# EAGLE design sepic 0.1 (EAGLE 9.6.2)
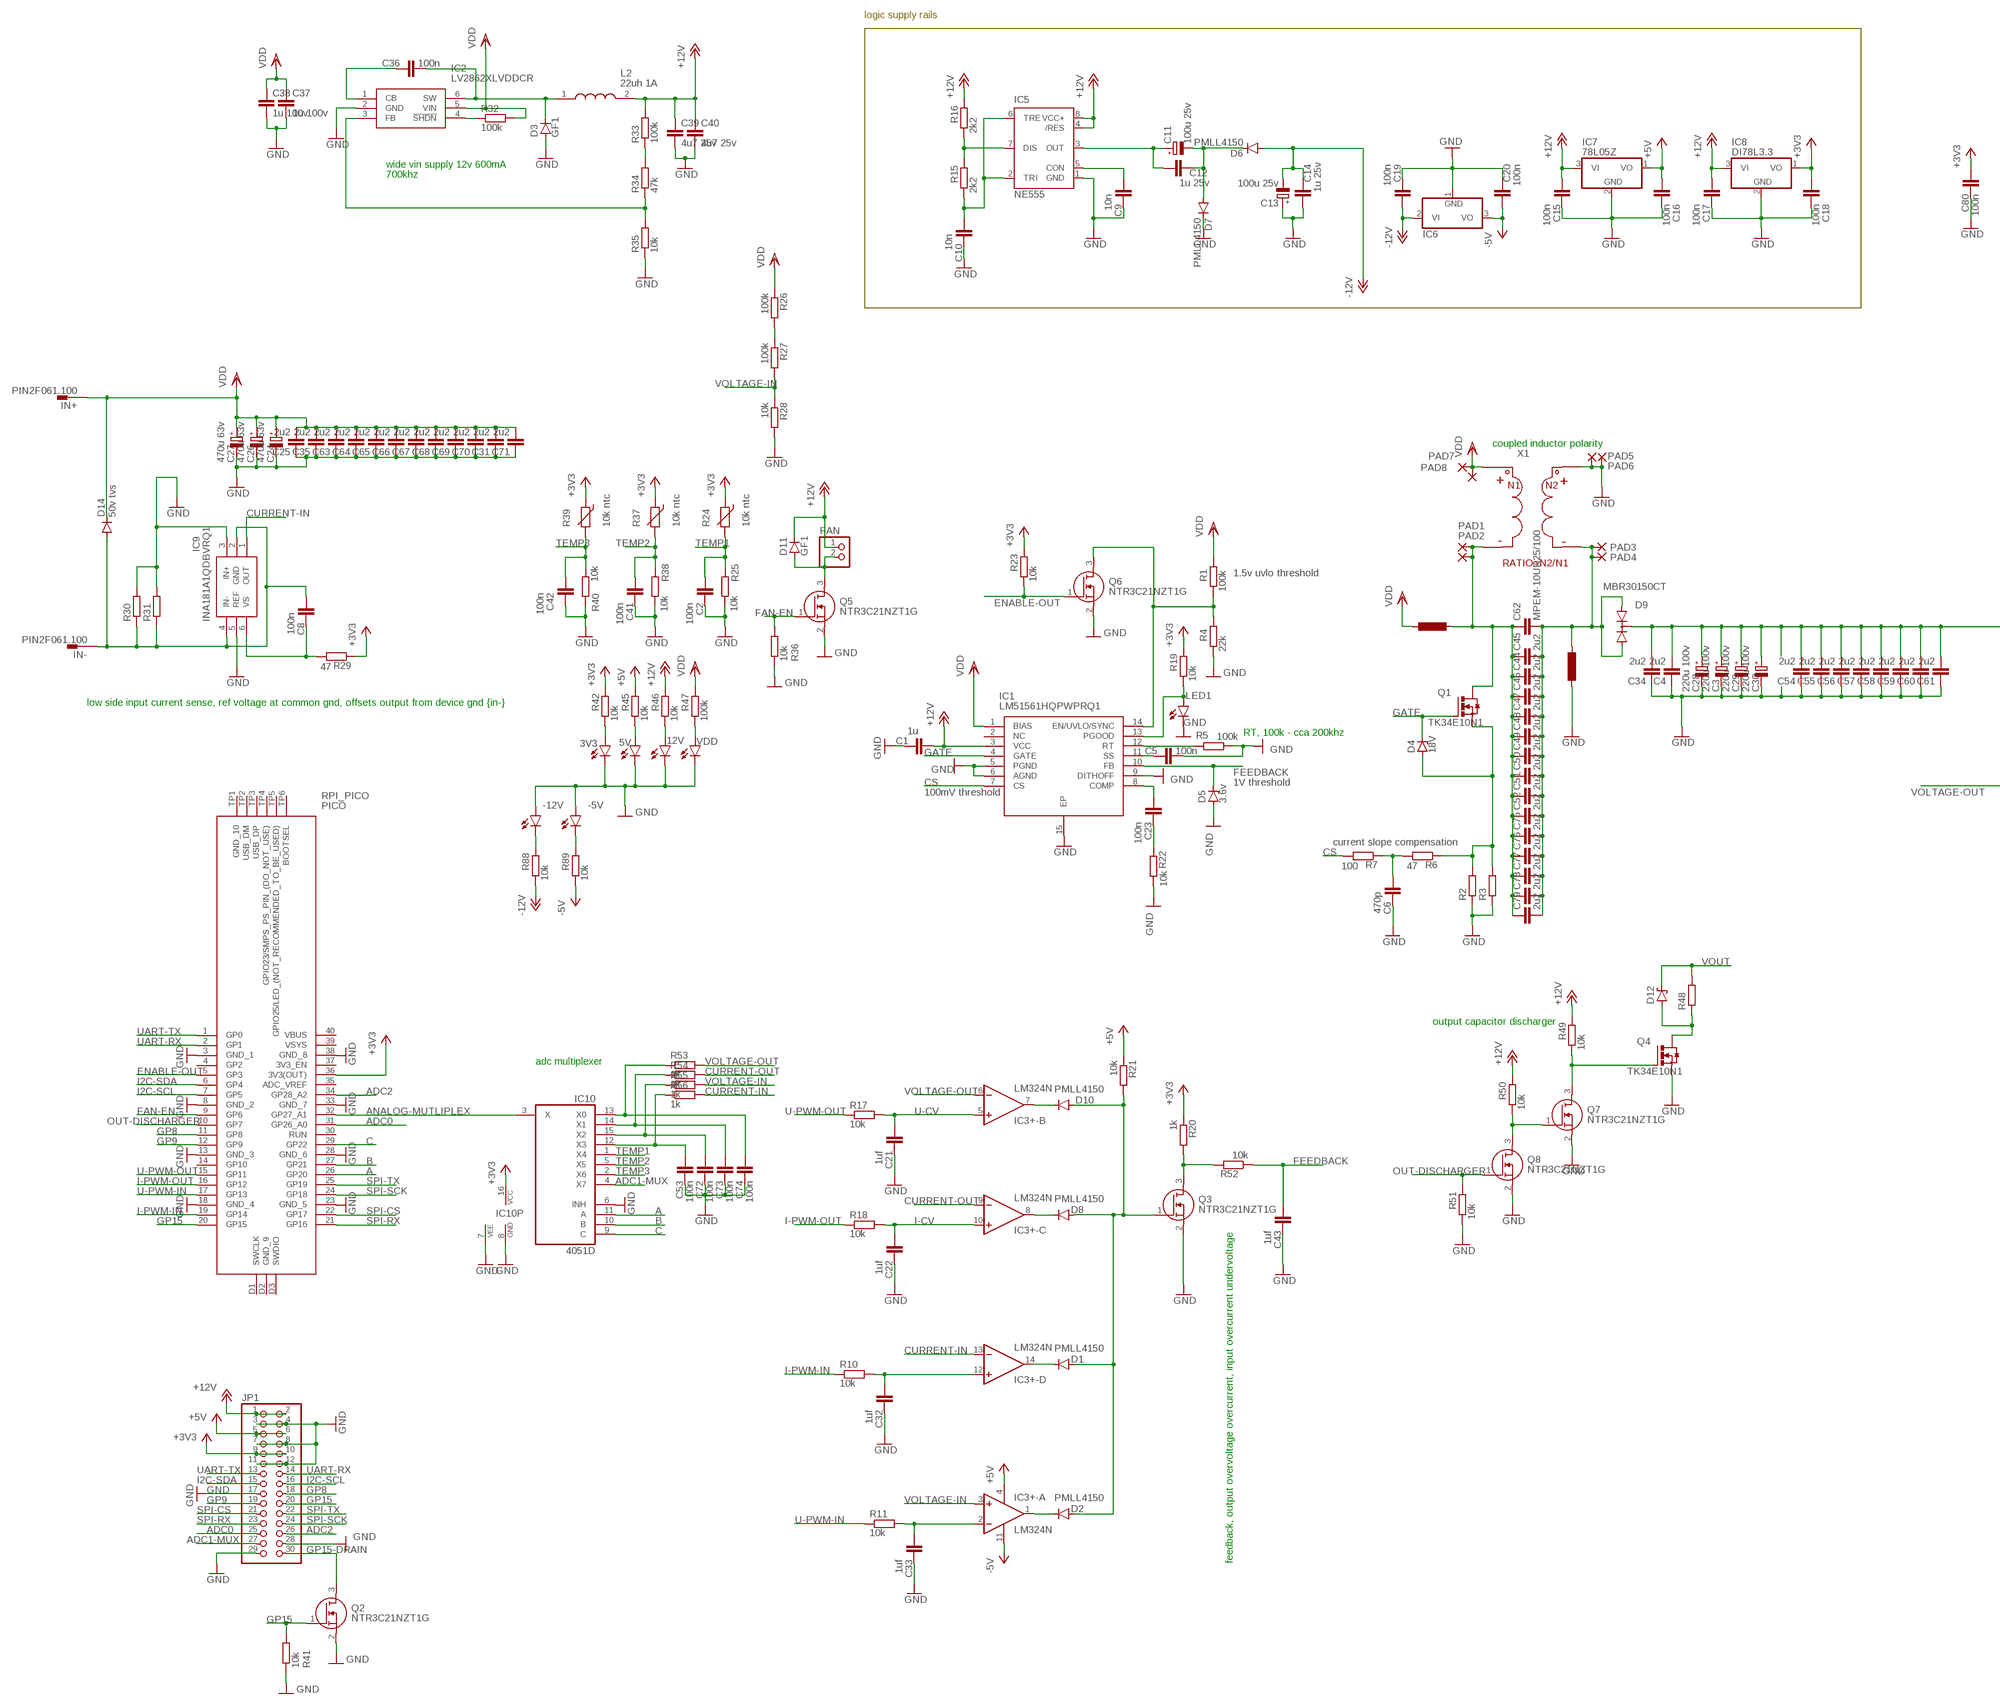
[diagram p0: schematic, sheet 1, part 1 of 2]
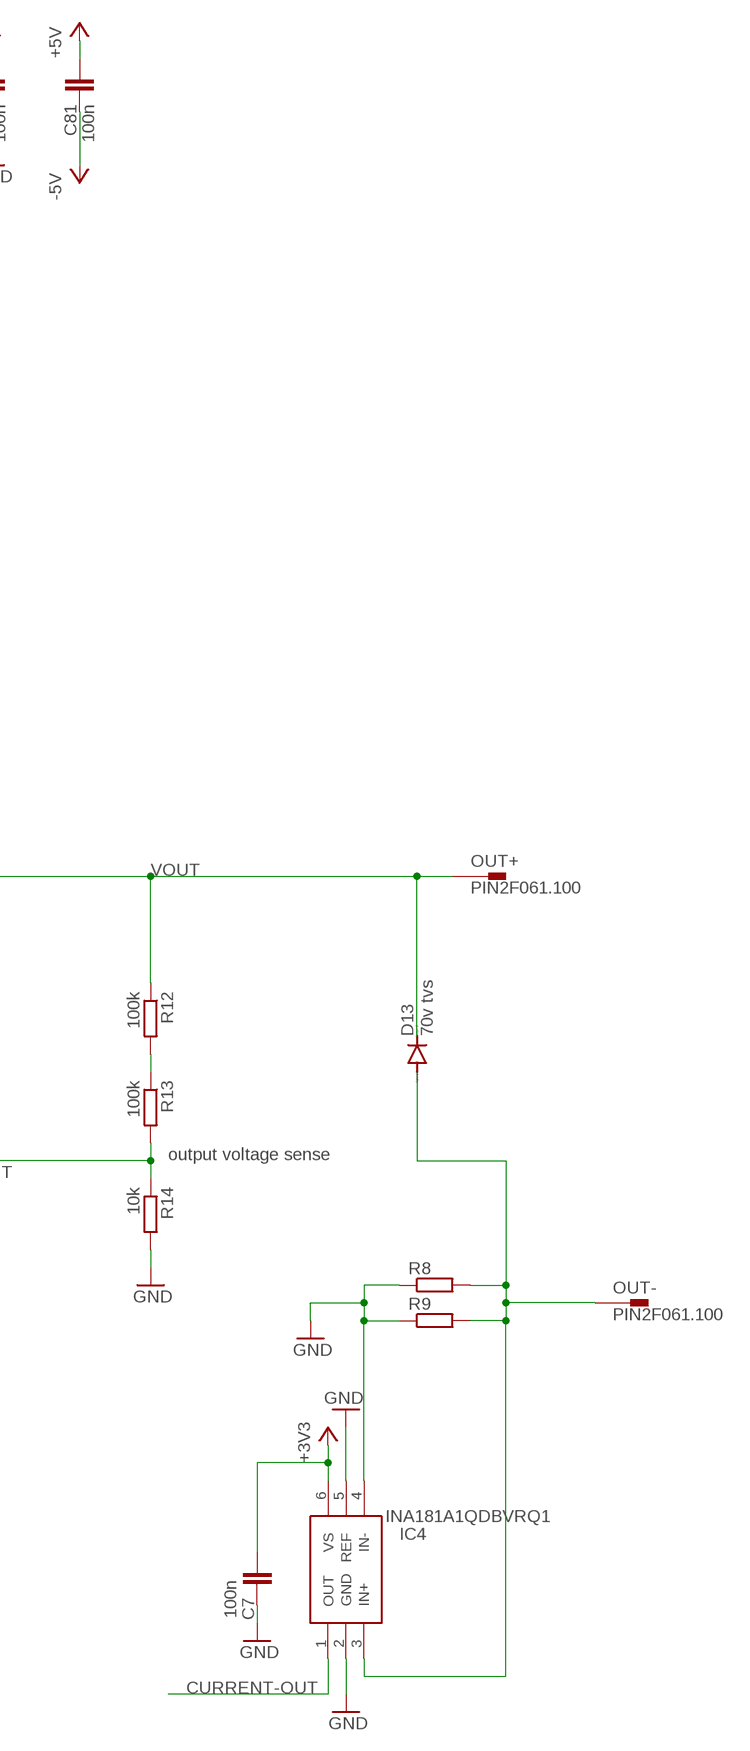
[diagram p1: schematic, sheet 1, part 2 of 2]

## Parts
3V3  LEDSML0805  [SML0805]
5V  LEDSML0805  [SML0805]
12V  LEDSML0805  [SML0805]
-5V  LEDSML0805  [SML0805]
-12V  LEDSML0805  [SML0805]
C1  1u  C-EUC0805  [C0805]
C2  100n  C-EUC0805  [C0805]
C3  220u 100v  CPOL-EUE7.5-16  [E7,5-16]
C4  2u2  C-EUC1210  [C1210]
C5  100n  C-EUC0805  [C0805]
C6  470p  C-EUC0805  [C0805]
C7  100n  C-EUC0805  [C0805]
C8  100n  C-EUC0805  [C0805]
C9  10n  C-EUC0805  [C0805]
C10  10n  C-EUC0805  [C0805]
C11  100u 25v  CPOL-EUE5-8.5  [E5-8,5]
C12  1u 25v  C-EUC0805  [C0805]
C13  100u 25v  CPOL-EUE5-8.5  [E5-8,5]
C14  1u 25v  C-EUC0805  [C0805]
C15  100n  C-EUC0805  [C0805]
C16  100n  C-EUC0805  [C0805]
C17  100n  C-EUC0805  [C0805]
C18  100n  C-EUC0805  [C0805]
C19  100n  C-EUC0805  [C0805]
C20  100n  C-EUC0805  [C0805]
C21  1uf  C-EUC0805  [C0805]
C22  1uf  C-EUC0805  [C0805]
C23  100n  C-EUC0805  [C0805]
C24  470u 63v  CPOL-EUE7.5-16  [E7,5-16]
C25  2u2  C-EUC1210  [C1210]
C26  470u 63v  CPOL-EUE7.5-16  [E7,5-16]
C27  470u 63v  CPOL-EUE7.5-16  [E7,5-16]
C28  220u 100v  CPOL-EUE7.5-16  [E7,5-16]
C29  220u 100v  CPOL-EUE7.5-16  [E7,5-16]
C30  220u 100v  CPOL-EUE7.5-16  [E7,5-16]
C31  2u2  C-EUC1210  [C1210]
C32  1uf  C-EUC0805  [C0805]
C33  1uf  C-EUC0805  [C0805]
C34  2u2  C-EUC1210  [C1210]
C35  2u2  C-EUC1210  [C1210]
C36  100n  C-EUC0805  [C0805]
C37  1u 100v  C-EUC1206  [C1206]
C38  1u 100v  C-EUC1206  [C1206]
C39  4u7 25v  C-EUC1206  [C1206]
C40  4u7 25v  C-EUC1206  [C1206]
C41  100n  C-EUC0805  [C0805]
C42  100n  C-EUC0805  [C0805]
C43  1uf  C-EUC0805  [C0805]
C44  2u2  C-EUC1210  [C1210]
C45  2u2  C-EUC1210  [C1210]
C46  2u2  C-EUC1210  [C1210]
C47  2u2  C-EUC1210  [C1210]
C48  2u2  C-EUC1210  [C1210]
C49  2u2  C-EUC1210  [C1210]
C50  2u2  C-EUC1210  [C1210]
C51  2u2  C-EUC1210  [C1210]
C52  2u2  C-EUC1210  [C1210]
C53  100n  C-EUC0805  [C0805]
C54  2u2  C-EUC1210  [C1210]
C55  2u2  C-EUC1210  [C1210]
C56  2u2  C-EUC1210  [C1210]
C57  2u2  C-EUC1210  [C1210]
C58  2u2  C-EUC1210  [C1210]
C59  2u2  C-EUC1210  [C1210]
C60  2u2  C-EUC1210  [C1210]
C61  2u2  C-EUC1210  [C1210]
C62  MPEM-10UR25/100  C-EU225-108X268  [C225-108X268]
C63  2u2  C-EUC1210  [C1210]
C64  2u2  C-EUC1210  [C1210]
C65  2u2  C-EUC1210  [C1210]
C66  2u2  C-EUC1210  [C1210]
C67  2u2  C-EUC1210  [C1210]
C68  2u2  C-EUC1210  [C1210]
C69  2u2  C-EUC1210  [C1210]
C70  2u2  C-EUC1210  [C1210]
C71  2u2  C-EUC1210  [C1210]
C72  100n  C-EUC0805  [C0805]
C73  100n  C-EUC0805  [C0805]
C74  100n  C-EUC0805  [C0805]
C75  2u2  C-EUC1210  [C1210]
C76  2u2  C-EUC1210  [C1210]
C77  2u2  C-EUC1210  [C1210]
C78  2u2  C-EUC1210  [C1210]
C79  2u2  C-EUC1210  [C1210]
C80  100n  C-EUC0805  [C0805]
C81  100n  C-EUC0805  [C0805]
D1  PMLL4150  [SOD80C]
D2  PMLL4150  [SOD80C]
D3  GF1  [SMA-DO214AC]
D4  18V  ZENER-DIODESOD80C  [SOD80C]
D5  3.6v  ZENER-DIODESOD80C  [SOD80C]
D6  PMLL4150  [SOD80C]
D7  PMLL4150  [SOD80C]
D8  PMLL4150  [SOD80C]
D9  MBR30150CT  BYW51F  [IW220ABS]
D10  PMLL4150  [SOD80C]
D11  GF1  [SMA-DO214AC]
D12  SCHOTTKY-DIODESMD  [SMB]
D13  70v tvs  DIODE-DO15-12  [DO15-12]
D14  50v tvs  DIODE-DO15-12  [DO15-12]
FAN  PINHD-1X2  [1X02]
IC1  LM51561HQPWPRQ1  [SOP65P640X120-15N]
IC2  LV2862XLVDDCR  [SOT95P280X110-6N]
IC3+-  LM324N  [DIL14]
IC4  INA181A1QDBVRQ1  [SOT95P280X145-6N]
IC5  NE555  [DIL-08]
IC6  79L05Z  [TO92]
IC7  78L05Z  [TO92]
IC8  DI78L3.3  78L05Z  [TO92]
IC9  INA181A1QDBVRQ1  [SOT95P280X145-6N]
IC10  4051D  [SO16]
IN+  PIN2F061.100  [F061.100]
IN-  PIN2F061.100  [F061.100]
JP1  PINHD-2X15  [2X15]
L2  22uh 1A  DER0705-47  [DER070547]
LED1  LEDSML0805  [SML0805]
OUT+  PIN2F061.100  [F061.100]
OUT-  PIN2F061.100  [F061.100]
PAD1  3,17/1,1  [3,17/1,1]
PAD2  3,17/1,1  [3,17/1,1]
PAD3  3,17/1,1  [3,17/1,1]
PAD4  3,17/1,1  [3,17/1,1]
PAD5  3,17/1,1  [3,17/1,1]
PAD6  3,17/1,1  [3,17/1,1]
PAD7  3,17/1,1  [3,17/1,1]
PAD8  3,17/1,1  [3,17/1,1]
Q1  TK34E10N1  IRF3704L-V  [TO262-V]
Q2  NTR3C21NZT1G  [SOT96P237X111-3N]
Q3  NTR3C21NZT1G  [SOT96P237X111-3N]
Q4  TK34E10N1  IRF3704L-V  [TO262-V]
Q5  NTR3C21NZT1G  [SOT96P237X111-3N]
Q6  NTR3C21NZT1G  [SOT96P237X111-3N]
Q7  NTR3C21NZT1G  [SOT96P237X111-3N]
Q8  NTR3C21NZT1G  [SOT96P237X111-3N]
R1  100k  R-EU_R0805  [R0805]
R2  R-EU_R2512  [R2512]
R3  R-EU_R2512  [R2512]
R4  22k  R-EU_R0805  [R0805]
R5  100k  R-EU_R0805  [R0805]
R6  47  R-EU_R0805  [R0805]
R7  100  R-EU_R0805  [R0805]
R8  R-EU_R2512  [R2512]
R9  R-EU_R2512  [R2512]
R10  10k  R-EU_R0805  [R0805]
R11  10k  R-EU_R0805  [R0805]
R12  100k  R-EU_R0805  [R0805]
R13  100k  R-EU_R0805  [R0805]
R14  10k  R-EU_R0805  [R0805]
R15  2k2  R-EU_R0805  [R0805]
R16  2k2  R-EU_R0805  [R0805]
R17  10k  R-EU_R0805  [R0805]
R18  10k  R-EU_R0805  [R0805]
R19  10k  R-EU_R0805  [R0805]
R20  1k  R-EU_R0805  [R0805]
R21  10k  R-EU_R0805  [R0805]
R22  10k  R-EU_R0805  [R0805]
R23  10k  R-EU_R0805  [R0805]
R24  10k ntc  THERMISTOR-2,5  [RS-2,5]
R25  10k  R-EU_R0805  [R0805]
R26  100k  R-EU_R0805  [R0805]
R27  100k  R-EU_R0805  [R0805]
R28  10k  R-EU_R0805  [R0805]
R29  47  R-EU_R0805  [R0805]
R30  R-EU_R2512  [R2512]
R31  R-EU_R2512  [R2512]
R32  100k  R-EU_R0805  [R0805]
R33  100k  R-EU_R0805  [R0805]
R34  47k  R-EU_R0805  [R0805]
R35  10k  R-EU_R0805  [R0805]
R36  10k  R-EU_R0805  [R0805]
R37  10k ntc  THERMISTOR-2,5  [RS-2,5]
R38  10k  R-EU_R0805  [R0805]
R39  10k ntc  THERMISTOR-2,5  [RS-2,5]
R40  10k  R-EU_R0805  [R0805]
R41  10k  R-EU_R0805  [R0805]
R42  10k  R-EU_R0805  [R0805]
R45  10k  R-EU_R0805  [R0805]
R46  10k  R-EU_R0805  [R0805]
R47  100k  R-EU_R0805  [R0805]
R48  R-EU_0817/22  [P0817/22]
R49  10k  R-EU_R0805  [R0805]
R50  10k  R-EU_R0805  [R0805]
R51  10k  R-EU_R0805  [R0805]
R52  10k  R-EU_R0805  [R0805]
R53  1k  R-EU_R0805  [R0805]
R54  1k  R-EU_R0805  [R0805]
R55  1k  R-EU_R0805  [R0805]
R56  1k  R-EU_R0805  [R0805]
R88  10k  R-EU_R0805  [R0805]
R89  10k  R-EU_R0805  [R0805]
RPI_PICO  PICO  [PICO]
VDD  LEDSML0805  [SML0805]
X1  TRANSFORMER  (no package)

## Nets
+3V3: C7.2 C18.2 C80.2 IC4.6(VS) IC8.1(VO) IC10.16(VCC) JP1.9 JP1.10 R19.2 R20.1 R23.2 R24.1 R29.1 R37.1 R39.1 R42.2 RPI_PICO.36(3V3(OUT))
+5V: C16.2 C81.2 IC3+-.4(P:V+) IC7.1(VO) JP1.5 JP1.6 R21.1 R45.2
+12V: C1.2 C15.2 C17.2 C39.1 C40.1 D11.K(C) FAN.1 IC1.3(VCC) IC5.4(/RES) IC5.8(VCC+) IC7.3(VI) IC8.3(VI) JP1.1 JP1.2 L2.2 R16.2 R33.2 R46.2 R49.2 R50.2
-5V: C20.1 C81.1 IC3+-.11(P:V-) IC6.3(VO) R89.1
-12V: C13.- C14.1 C19.1 D6.A IC6.2(VI) R88.1
A: IC10.11(A) RPI_PICO.26(GP20)
ADC0: JP1.25 RPI_PICO.31(GP26_A0)
ADC1-MUX: IC10.4(X7) JP1.27
ADC2: JP1.26 RPI_PICO.34(GP28_A2)
ANALOG-MUTLIPLEX: IC10.3(X) RPI_PICO.32(GP27_A1)
B: IC10.10(B) RPI_PICO.27(GP21)
C: IC10.9(C) RPI_PICO.29(GP22)
CS: IC1.7(CS) R7.2
CS1: D4.A Q1.3(S) R2.2 R3.2 R6.1
CURRENT-IN: IC3+-.13(D:-IN) IC9.1(OUT) R56.2
CURRENT-OUT: IC3+-.9(C:-IN) IC4.1(OUT) R54.2
ENABLE-OUT: Q6.1(G) R23.1 RPI_PICO.5(GP3)
FAN-EN: Q5.1(G) R36.2 RPI_PICO.9(GP6)
FEEDBACK: C43.2 D5.C IC1.10(FB) R52.1
GATE: D4.C IC1.4(GATE) Q1.1(G)
GND: 3V3.C 5V.C 12V.C -5V.A -12V.A C1.1 C2.1 C3.- C4.1 C5.2 C6.1 C7.1 C9.1 C10.1 C13.+ C14.2 C15.1 C16.1 C17.1 C18.1 C19.2 C20.2 C21.1 C22.1 C24.- C25.1 C26.- C27.- C28.- C29.- C30.- C31.1 C32.1 C33.1 C34.1 C35.1 C37.2 C38.2 C39.2 C40.2 C41.1 C42.1 C43.1 C53.1 C54.1 C55.1 C56.1 C57.1 C58.1 C59.1 C60.1 C61.1 C63.1 C64.1 C65.1 C66.1 C67.1 C68.1 C69.1 C70.1 C71.1 C72.1 C73.1 C74.1 C80.1 D3.A D5.A D7.C IC1.5(PGND) IC1.6(AGND) IC1.9(DITHOFF) IC1.15(EP) IC2.2(GND) IC4.2(GND) IC4.4(IN-) IC4.5(REF) IC5.1(GND) IC6.1(GND) IC7.2(GND) IC8.2(GND) IC9.3(IN+) IC9.5(REF) IC10.6(INH) IC10.7(VEE) IC10.8(GND) JP1.3 JP1.4 JP1.7 JP1.8 JP1.11 JP1.12 JP1.17 JP1.28 JP1.29 LED1.C PAD5.1(P) PAD6.1(P) Q2.2(S) Q3.2(S) Q4.3(S) Q5.2(S) Q6.2(S) Q7.2(S) Q8.2(S) R2.1 R3.1 R4.1 R5.1 R8.1 R9.1 R14.2 R22.2 R25.1 R28.2 R30.2 R31.2 R35.1 R36.1 R38.1 R40.1 R41.1 R51.1 RPI_PICO.3(GND_1) RPI_PICO.8(GND_2) RPI_PICO.13(GND_3) RPI_PICO.18(GND_4) RPI_PICO.23(GND_5) RPI_PICO.28(GND_6) RPI_PICO.33(GND_7) RPI_PICO.38(GND_8) VDD.C X1.P$3
GP8: JP1.18 RPI_PICO.11(GP8)
GP9: JP1.19 RPI_PICO.12(GP9)
GP15: JP1.20 Q2.1(G) R41.2 RPI_PICO.20(GP15)
GP15-DRAIN: JP1.30 Q2.3(D)
I2C-SCL: JP1.16 RPI_PICO.7(GP5)
I2C-SDA: JP1.15 RPI_PICO.6(GP4)
I-CV: C22.2 IC3+-.10(C:+IN) R18.2
I-PWM-IN: R10.1 RPI_PICO.19(GP14)
I-PWM-OUT: R18.1 RPI_PICO.16(GP12)
IN_GND: C8.2 D14.A IC9.2(GND) IC9.4(IN-) IN-.A1 IN-.A2 R30.1 R31.1
N$1: IC1.14(EN/UVLO/SYNC) Q6.3(D) R1.1 R4.2
N$2: C44.1 C45.1 C46.1 C47.1 C48.1 C49.1 C50.1 C51.1 C52.1 C62.1 C75.1 C76.1 C77.1 C78.1 C79.1 PAD1.1(P) PAD2.1(P) Q1.2(D) X1.P$2
N$3: C44.2 C45.2 C46.2 C47.2 C48.2 C49.2 C50.2 C51.2 C52.2 C62.2 C75.2 C76.2 C77.2 C78.2 C79.2 D9.A1 D9.A2 PAD3.1(P) PAD4.1(P) X1.P$4
N$4: C6.2 R6.2 R7.1
N$5: IC1.12(RT) R5.2
N$6: C5.1 IC1.11(SS)
N$7: C53.2 IC10.12(X3) R56.1
N$8: D10.C IC3+-.7(B:OUT)
N$9: D1.C IC3+-.14(D:OUT)
N$10: R12.2 R13.1
N$11: IC5.7(DIS) R15.2 R16.1
N$12: C10.2 IC5.2(TRI) IC5.6(TRE) R15.1
N$13: C9.2 IC5.5(CON)
N$14: C11.+ C12.2 IC5.3(OUT)
N$15: C11.- C12.1 D6.C D7.A
N$16: D8.C IC3+-.8(C:OUT)
N$17: D1.A D2.A D8.A D10.A Q3.1(G) R21.2
N$18: IC1.13(PGOOD) LED1.A R19.1
N$19: C23.2 IC1.8(COMP)
N$20: C23.1 R22.1
N$21: C32.2 IC3+-.12(D:+IN) R10.2
N$22: IC2.4(!SHDN) R32.1
N$23: C36.2 D3.K(C) IC2.6(SW) L2.1
N$24: D11.A FAN.2 Q5.3(D)
N$25: C36.1 IC2.1(CB)
N$26: R26.2 R27.1
N$27: C72.2 IC10.15(X2) R55.1
N$28: D2.C IC3+-.1(A:OUT)
N$29: C8.1 IC9.6(VS) R29.2
N$30: C33.2 IC3+-.2(A:-IN) R11.2
N$31: R33.1 R34.2
N$32: IC2.3(FB) R34.1 R35.2
N$33: 3V3.A R42.1
N$34: 5V.A R45.1
N$35: 12V.A R46.1
N$36: R47.1 VDD.A
N$37: -5V.C R89.2
N$38: -12V.C R88.2
N$39: D12.A Q4.2(D) R48.1
N$40: Q4.1(G) Q7.3(D) R49.1
N$41: Q7.1(G) Q8.3(D) R50.1
N$42: Q3.3(D) R20.2 R52.2
N$43: C73.2 IC10.14(X1) R54.1
N$44: C74.2 IC10.13(X0) R53.1
OUT-DISCHARGER: Q8.1(G) R51.2 RPI_PICO.10(GP7)
OUT_GND: D13.A IC4.3(IN+) OUT-.A1 OUT-.A2 R8.2 R9.2
SPI-CS: JP1.21 RPI_PICO.22(GP17)
SPI-RX: JP1.23 RPI_PICO.21(GP16)
SPI-SCK: JP1.24 RPI_PICO.24(GP18)
SPI-TX: JP1.22 RPI_PICO.25(GP19)
TEMP1: C2.2 IC10.1(X4) R24.2 R25.2
TEMP2: C41.2 IC10.5(X5) R37.2 R38.2
TEMP3: C42.2 IC10.2(X6) R39.2 R40.2
U-CV: C21.2 IC3+-.5(B:+IN) R17.2
U-PWM-IN: R11.1 RPI_PICO.17(GP13)
U-PWM-OUT: R17.1 RPI_PICO.15(GP11)
UART-RX: JP1.14 RPI_PICO.2(GP1)
UART-TX: JP1.13 RPI_PICO.1(GP0)
VDD: C24.+ C25.2 C26.+ C27.+ C31.2 C35.2 C37.1 C38.1 C63.2 C64.2 C65.2 C66.2 C67.2 C68.2 C69.2 C70.2 C71.2 D14.C IC1.1(BIAS) IC2.5(VIN) IN+.A1 IN+.A2 PAD7.1(P) PAD8.1(P) R1.2 R26.1 R32.2 R47.2 X1.P$1
VOLTAGE-IN: IC3+-.3(A:+IN) R27.2 R28.1 R55.2
VOLTAGE-OUT: IC3+-.6(B:-IN) R13.2 R14.1 R53.2
VOUT: C3.+ C4.2 C28.+ C29.+ C30.+ C34.2 C54.2 C55.2 C56.2 C57.2 C58.2 C59.2 C60.2 C61.2 D9.C D12.C D13.C OUT+.A1 OUT+.A2 R12.1 R48.2
Unconnected: IC1.2(NC) RPI_PICO.4(GP2) RPI_PICO.14(GP10) RPI_PICO.30(RUN) RPI_PICO.35(ADC_VREF) RPI_PICO.37(3V3_EN) RPI_PICO.39(VSYS) RPI_PICO.40(VBUS) RPI_PICO.D1(SWCLK) RPI_PICO.D2(GND_9) RPI_PICO.D3(SWDIO) RPI_PICO.TP1(GND_10) RPI_PICO.TP2(USB_DM) RPI_PICO.TP3(USB_DP) RPI_PICO.TP4(GPIO23/SMPS_PS_PIN_(DO_NOT_USE)) RPI_PICO.TP5(GPIO25/LED_(NOT_RECOMMENDED_TO_BE_USED)) RPI_PICO.TP6(BOOTSEL)

## Notes on the sheet
- logic supply rails
- wide vin supply 12v 600mA
- 700khz
- coupled inductor polarity
- 1.5v uvlo threshold
- low side input current sense, ref voltage at common gnd, offsets output from device gnd {in-}
- RT, 100k - cca 200khz
- 1V threshold | output voltage sense
- 100mV threshold
- current slope compensation
- output capacitor discharger
- adc multiplexer
- feedback, output overvoltage overcurrent, input overcurrent undervoltage

## Library data of the parts
3V3 5V 12V -5V -12V LED1 VDD = led:LED: LED OSRAM: - CHIPLED LG R971, LG N971, LY N971, LG Q971, LY Q971, LO R971, LY R971 LH N974, LH R974 LS Q976, LO Q976, LY Q976 LO Q996 - Hyper CHIPLED LW Q18S LB Q993, LB Q99A, LB R99A - SideLED LS A670, LO A670, LY A670, LG A670, LP A670 LB A673, LV A673, LT A673, LW A673 LH A674 LY A675 LS A676, LA A676, LO A676, LY A676, LW A676 LS A679, LY A679, LG A679 - Hyper Micro SIDELED® LS Y876, LA Y876, LO Y876, LY Y876 LT Y87S - SmartLED LW L88C, LW L88S LB L89C, LB L89S, LG L890 LS L89K, LO L89K, LY L89K LS L896, LA L896, LO L896, LY L896 - TOPLED LS T670, LO T670, LY T670, LG T670, LP T670 LSG T670, LSP T670, LSY T670, LOP T670, LYG T670 LG T671, LOG T671, LSG T671 LB T673, LV T673, LT T673, LW T673 LH T674 LS T676, LA T676, LO T676, LY T676, LB T676, LH T676, LSB T676, LW T676 LB T67C, LV T67C, LT T67C, LS T67K, LO T67K, LY T67K, LW E67C LS E67B, LA E67B, LO E67B, LY E67B, LB E67C, LV E67C, LT E67C LW T67C LS T679, LY T679, LG T679 LS T770, LO T770, LY T770, LG T770, LP T770 LB T773, LV T773, LT T773, LW T773 LH T774 LS E675, LA E675, LY E675, LS T675 LS T776, LA T776, LO T776, LY T776, LB T776 LHGB T686 LT T68C, LB T68C - Hyper Mini TOPLED® LB M676 - Mini TOPLED Santana® LG M470 LS M47K, LO M47K, LY M47K Source: http://www.osram.convergy.de LUXEON: - LUMILED® LXK2-PW12-R00, LXK2-PW12-S00, LXK2-PW14-U00, LXK2-PW14-V00 LXK2-PM12-R00, LXK2-PM12-S00, LXK2-PM14-U00 LXK2-PE12-Q00, LXK2-PE12-R00, LXK2-PE12-S00, LXK2-PE14-T00, LXK2-PE14-U00 LXK2-PB12-K00, LXK2-PB12-L00, LXK2-PB12-M00, LXK2-PB14-N00, LXK2-PB14-P00, LXK2-PB14-Q00 LXK2-PR12-L00, LXK2-PR12-M00, LXK2-PR14-Q00, LXK2-PR14-R00 LXK2-PD12-Q00, LXK2-PD12-R00, LXK2-PD12-S00 LXK2-PH12-R00, LXK2-PH12-S00 LXK2-PL12-P00, LXK2-PL12-Q00, LXK2-PL12-R00 Source: www.luxeon.com KINGBRIGHT: KA-3528ASYC Source: www.kingbright.com
C1 C2 C4-C10 C12 C14-C23 C25 C31-C81 = rcl:C-EU: CAPACITOR, European symbol; SPICEPREFIX: C
C3 C11 C13 C24 C26-C30 = rcl:CPOL-EU: POLARIZED CAPACITOR, European symbol; SPICEPREFIX: C
D1 D2 D6-D8 D10 = diode:PMLL4150: DIODE high speed
D3 D11 = diode:GF1: DIODE
D4 D5 = diode:ZENER-DIODE: Z-Diode
D9 = diode:BYW51F: DIODE dual ultra fast diode, 200 V (ST)
D12 = diode:SCHOTTKY-DIODE: Schottky Diode
D13 D14 = diode:DIODE-: DIODE
FAN = pinhead:PINHD-1X2: PIN HEADER
IC1 = SamacSys_Parts:LM51561HQPWPRQ1: Switching Controllers 2.2-MHz wide VIN nonsynchronous boost, flyback, & SEPIC controller with spread spectrum and hiccup 14-HTSSOP -40 to 150 Source: Datasheet <https://www.ti.com/lit/ds/symlink/lm51561h-q1.pdf?ts=1627804553819&ref_url=https%3A%2F%2Fwww.ti.com%2Fstore%2Fti%2Fen%2Fp%2Fproduct%2F%3Fp%3DLM51561HQPWPRQ1>; ARROW_PART_NUMBER: LM51561HQPWPRQ1; ARROW_PRICE-STOCK: https://www.arrow.com/en/products/lm51561hqpwprq1/texas-instruments?region=nac; DESCRIPTION: Switching Controllers 2.2-MHz wide VIN nonsynchronous boost, flyback, & SEPIC controller with spread spectrum and hiccup 14-HTSSOP -40 to 150; HEIGHT: 1.2mm; MANUFACTURER_NAME: Texas Instruments; MANUFACTURER_PART_NUMBER: LM51561HQPWPRQ1; MOUSER_PART_NUMBER: 595-LM51561HQPWPRQ1; MOUSER_PRICE-STOCK: https://www.mouser.co.uk/ProductDetail/Texas-Instruments/LM51561HQPWPRQ1?qs=zW32dvEIR3vSrITqODfvSg%3D%3D
IC2 = SamacSys_Parts:LV2862XLVDDCR: Conv DC-DC 4V to 60V Step Down Single-Out -1V to 65V 0.6A Automotive T/R Source: Datasheet <https://www.ti.com/lit/gpn/LV2862>; ARROW_PART_NUMBER: LV2862XLVDDCR; ARROW_PRICE-STOCK: https://www.arrow.com/en/products/lv2862xlvddcr/texas-instruments?region=nac; DESCRIPTION: Conv DC-DC 4V to 60V Step Down Single-Out -1V to 65V 0.6A Automotive T/R; HEIGHT: 1.1mm; MANUFACTURER_NAME: Texas Instruments; MANUFACTURER_PART_NUMBER: LV2862XLVDDCR; MOUSER_PART_NUMBER: 595-LV2862XLVDDCR; MOUSER_PRICE-STOCK: https://www.mouser.co.uk/ProductDetail/Texas-Instruments/LV2862XLVDDCR?qs=XJu%252BLGjWfSCoT1RiKkHrOA%3D%3D
IC3+- = linear:LM324: OP AMP
IC4 IC9 = SamacSys_Parts:INA181A1QDBVRQ1: AEC-Q100, 26V, bi-directional, low-/high-side, voltage output current sense amplifier Source: Datasheet <http://www.ti.com/lit/gpn/INA181-Q1>; ARROW_PART_NUMBER: INA181A1QDBVRQ1; ARROW_PRICE-STOCK: https://www.arrow.com/en/products/ina181a1qdbvrq1/texas-instruments?region=nac; DESCRIPTION: AEC-Q100, 26V, bi-directional, low-/high-side, voltage output current sense amplifier; HEIGHT: 1.45mm; MANUFACTURER_NAME: Texas Instruments; MANUFACTURER_PART_NUMBER: INA181A1QDBVRQ1; MOUSER_PART_NUMBER: 595-INA181A1QDBVRQ1; MOUSER_PRICE-STOCK: https://www.mouser.co.uk/ProductDetail/Texas-Instruments/INA181A1QDBVRQ1?qs=EBDBlbfErPx7yYU5sEtaJQ%3D%3D
IC5 = st-microelectronics:NE555: General purpose bipolar Timer; MF: Arrow Electronics; MPN: NE555N; OC_FARNELL: 1467742; OC_NEWARK: 89K1486
IC6 = linear:79*: Negative VOLTAGE REGULATOR
IC7 IC8 = linear:78*: Positive VOLTAGE REGULATOR Source: http://cache.national.com/ds/LM/LM78L05.pdf http://www.fairchildsemi.com/ds/LM/LM7805.pdf
IC10 = 40xx:4051: 8-channel ANALOG MULTIPLEXER
IN+ IN- OUT+ OUT- = con-faston:PIN2: Flachstecker Typ Tyco/Electronics/AMP TAB, FASTON Printed Circuit Board Tabs Source: http://www.buerklin.com, http://catalog.tycoelectronics.com; OC_FARNELL: unknown; OC_NEWARK: unknown
JP1 = pinhead:PINHD-2X15: PIN HEADER
L2 = SamacSys_Parts:DER0705-47: Inductor: wire; SMD; 47uH; 0.75A; 0.221; 7.6x7.6x5.1mm; +/-20% Source: Datasheet <https://www.tme.eu/Document/9a80d44ac7714b3daaf4f9db6ecfd32c/der.pdf>; DESCRIPTION: Inductor: wire; SMD; 47uH; 0.75A; 0.221; 7.6x7.6x5.1mm; +/-20%; HEIGHT: 5.1mm; MANUFACTURER_NAME: FERROCORE; MANUFACTURER_PART_NUMBER: DER0705-47
PAD1-PAD8 = wirepad:3,17/1,1: THROUGH-HOLE PAD
Q1 Q4 = transistor-power:IRF3704: SMPS MOSFET HEXFET® Power MOSFET Source: http://www.irf.com/product-info/datasheets/data/irf3704.pdf
Q2 Q3 Q5-Q8 = SamacSys_Parts:NTR3C21NZT1G: ON SEMICONDUCTOR - NTR3C21NZT1G - MOSFET, N-CH, 20V, 3.6A, SOT-23 Source: Datasheet <https://mouser.componentsearchengine.com/Datasheets/2/NTR3C21NZT1G.pdf>; ARROW_PART_NUMBER: NTR3C21NZT1G; ARROW_PRICE-STOCK: https://www.arrow.com/en/products/ntr3c21nzt1g/on-semiconductor; DESCRIPTION: ON SEMICONDUCTOR - NTR3C21NZT1G - MOSFET, N-CH, 20V, 3.6A, SOT-23; HEIGHT: 1.11mm; MANUFACTURER_NAME: onsemi; MANUFACTURER_PART_NUMBER: NTR3C21NZT1G; MOUSER_PART_NUMBER: 863-NTR3C21NZT1G; MOUSER_PRICE-STOCK: https://www.mouser.co.uk/ProductDetail/onsemi/NTR3C21NZT1G?qs=tCMd4XlZ%2FiDqlfJKftdpPA%3D%3D
R1-R23 R25-R36 R38 R40-R42 R45-R56 R88 R89 = rcl:R-EU_: RESISTOR, European symbol; SPICEPREFIX: R
R24 R37 R39 = varistor:THERMISTOR: THERMISTOR
RPI_PICO = SamacSys_Parts:PICO: RP2040 microcontroller chip designed by Raspberry Pi in the United Kingdom 2 SPI, 2 I2C, 2 UART, 3 12-bit ADC, 16 controllable PWM channels Source: Datasheet <https://datasheets.raspberrypi.org/pico/pico_datasheet.pdf>; DESCRIPTION: RP2040 microcontroller chip designed by Raspberry Pi in the United Kingdom 2 SPI, 2 I2C, 2 UART, 3 12-bit ADC, 16 controllable PWM channels; HEIGHT: 1mm; MANUFACTURER_NAME: RASPBERRY-PI; MANUFACTURER_PART_NUMBER: PICO
X1 = ngspice-simulation:TRANSFORMER: Coupled inductors The RATIO is defined in the schematic by using the text command and adding a line that says: .PARAM RATIO=x Where x is the turns ratio of the transformer

## Board
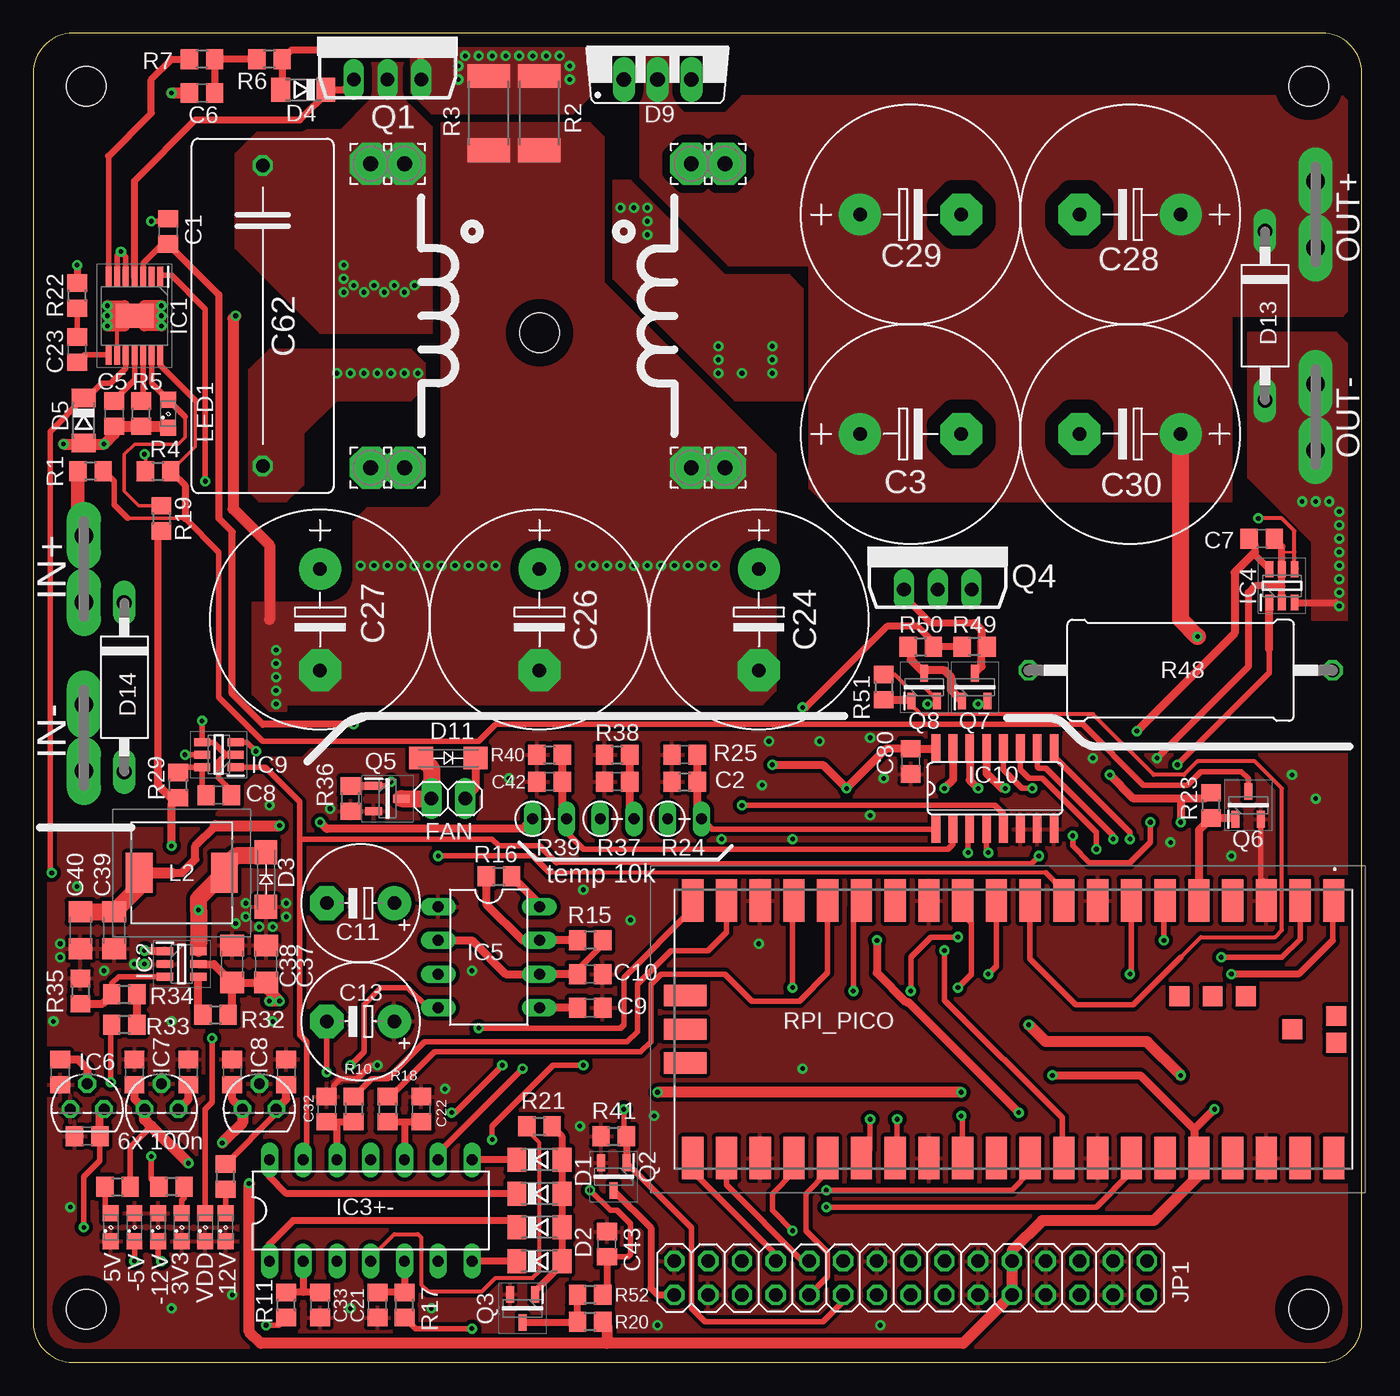
[diagram p2: board, top side]
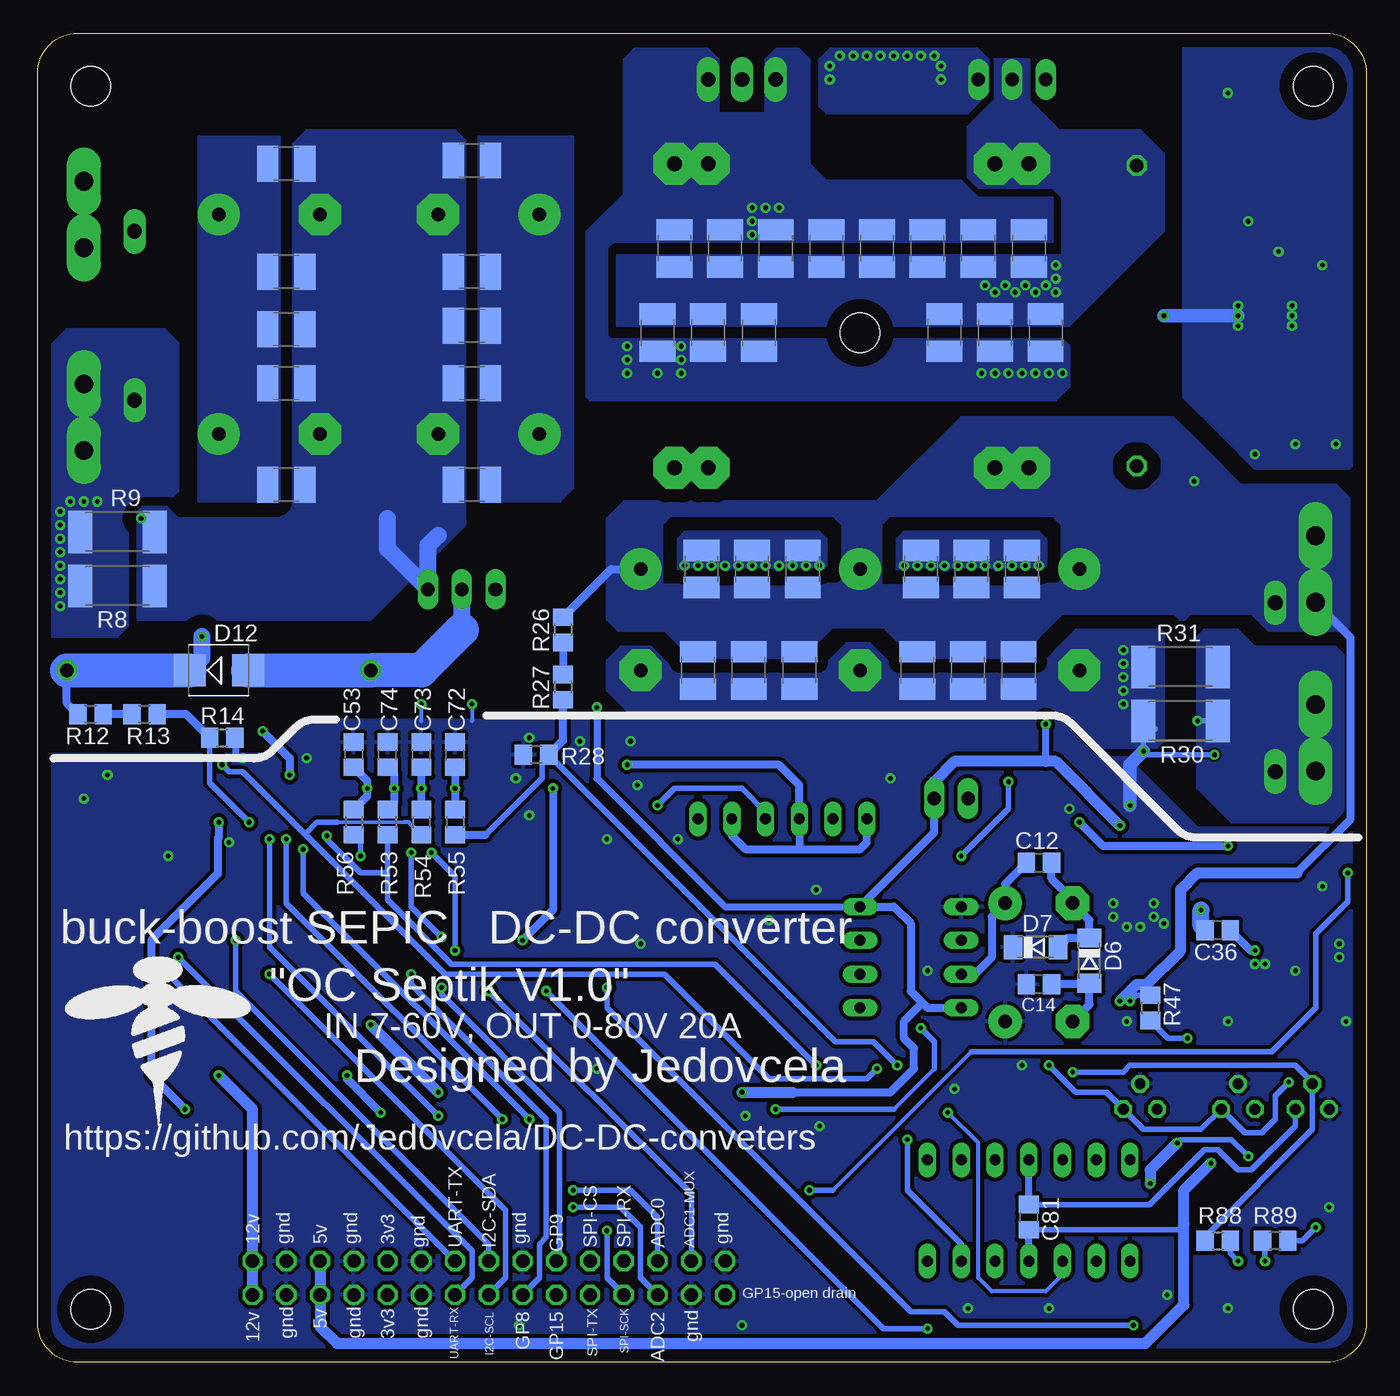
[diagram p3: board, bottom side, seen from below]

Size 100 x 100 mm. Coordinates in mm from the lower left corner, seen from the top.
Outline: 0,97 0,3 arc90 3,0 97,0 arc90 100,3 100,97 arc90 97,100 3,100 arc90 0,97
Copper layers (1*16): Top 0.035mm / dielectric 1.5mm / Bottom 0.035mm
Design rules "default *": minimum track width 6mil, minimum drill 0.35mm, track to track 6mil, track to pad 6mil, pad to pad 6mil, via to via 6mil, smd to smd 6mil, copper to edge 40mil, drill to drill 6mil, minimum pad ring 10mil, minimum via ring 8mil, stop-mask expansion 4mil, vias tented up to drill 15mil, thermal gap 10mil
Holes 3 mm at 4,96 96,96 96,4 4,4 38.1,77.47

### Footprints (pad centres in the part's own frame; a part is rotated, then mirrored left to right if it is on the bottom)
SML0805 = smd 1.2 x 1.2: A 1.05,0; C -1.05,0
C0805 = smd 1.3 x 1.5: 1 -0.95,0; 2 0.95,0
E7,5-16 = drill 1.016 pad 3.15: + -3.81,0 | drill 1.016 pad 3.15 octagon: - 3.81,0
C1210 = smd 1.6 x 2.7: 1 -1.4,0; 2 1.4,0
E5-8,5 = drill 1.016 pad 2.54: + -2.54,0 | drill 1.016 pad 2.54 octagon: - 2.54,0
C1206 = smd 1.6 x 1.8: 1 -1.4,0; 2 1.4,0
C225-108X268 = drill 1.016 octagon: 1 -11.303,0; 2 11.303,0
SOD80C = smd 1.4 x 1.8: A 1.7,0; C -1.7,0
SMA-DO214AC = smd 1.8 x 1.7: A -2.05,0; K 2.05,0
IW220ABS = drill 1.118 long: A1 -2.54,-2.54; A2 2.54,-2.54; C 0,-2.54
SMB = smd 2.4 x 2.4: A 2.2,0; C -2.2,0
DO15-12 = drill 1.118 long: A 6.35,0; C -6.35,0
1X02 = drill 1.016 long: 1 -1.27,0; 2 1.27,0
SOP65P640X120-15N = smd 1.475 x 0.45: 1 -2.938,1.95; 2 -2.938,1.3; 3 -2.938,0.65; 4 -2.938,0; 5 -2.938,-0.65; 6 -2.938,-1.3; 7 -2.938,-1.95; 8 2.938,-1.95; 9 2.938,-1.3; 10 2.938,-0.65; 11 2.938,0; 12 2.938,0.65; 13 2.938,1.3; 14 2.938,1.95 | smd 1.82 x 2.86: 15 0,0
SOT95P280X110-6N = smd 1.25 x 0.6: 1 -1.25,0.95; 2 -1.25,0; 3 -1.25,-0.95; 4 1.25,-0.95; 5 1.25,0; 6 1.25,0.95
DIL14 = drill 0.813 long: 1 -7.62,-3.81; 2 -5.08,-3.81; 3 -2.54,-3.81; 4 0,-3.81; 5 2.54,-3.81; 6 5.08,-3.81; 7 7.62,-3.81; 8 7.62,3.81; 9 5.08,3.81; 10 2.54,3.81; 11 0,3.81; 12 -2.54,3.81; 13 -5.08,3.81; 14 -7.62,3.81
SOT95P280X145-6N = smd 1.2 x 0.6: 1 -1.25,0.95; 2 -1.25,0; 3 -1.25,-0.95; 4 1.25,-0.95; 5 1.25,0; 6 1.25,0.95
DIL-08 = drill 0.813 long: 1 -3.81,-3.81; 2 -1.27,-3.81; 3 1.27,-3.81; 4 3.81,-3.81; 5 3.81,3.81; 6 1.27,3.81; 7 -1.27,3.81; 8 -3.81,3.81
TO92 = drill 0.813 octagon: 1 -1.27,0; 2 0,1.905; 3 1.27,0
SO16 = smd 0.66 x 2.032: 1 -4.445,-3.073; 2 -3.175,-3.073; 3 -1.905,-3.073; 4 -0.635,-3.073; 5 0.635,-3.073; 6 1.905,-3.073; 7 3.175,-3.073; 8 4.445,-3.073; 9 4.445,3.073; 10 3.175,3.073; 11 1.905,3.073; 12 0.635,3.073; 13 -0.635,3.073; 14 -1.905,3.073; 15 -3.175,3.073; 16 -4.445,3.073
F061.100 = drill 1.4 pad 2.54 long: A1 -2.5,0; A2 2.5,0
2X15 = drill 1.016 octagon: 1 -17.78,-1.27; 2 -17.78,1.27; 3 -15.24,-1.27; 4 -15.24,1.27; 5 -12.7,-1.27; 6 -12.7,1.27; 7 -10.16,-1.27; 8 -10.16,1.27; 9 -7.62,-1.27; 10 -7.62,1.27; 11 -5.08,-1.27; 12 -5.08,1.27; 13 -2.54,-1.27; 14 -2.54,1.27; 15 0,-1.27; 16 0,1.27; 17 2.54,-1.27; 18 2.54,1.27; 19 5.08,-1.27; 20 5.08,1.27; 21 7.62,-1.27; 22 7.62,1.27; 23 10.16,-1.27; 24 10.16,1.27; 25 12.7,-1.27; 26 12.7,1.27; 27 15.24,-1.27; 28 15.24,1.27; 29 17.78,-1.27; 30 17.78,1.27
DER070547 = smd 2 x 3: 1 -3.2,0; 2 3.2,0
3,17/1,1 = drill 1.118 pad 3.175 octagon: 1 0,0
TO262-V = drill 1.016 long: 1 -2.54,0; 2 0,0; 3 2.54,0
SOT96P237X111-3N = smd 1.25 x 0.6: 1 -1.05,0.955; 2 -1.05,-0.955; 3 1.05,0
R0805 = smd 1.3 x 1.5: 1 -0.95,0; 2 0.95,0
R2512 = smd 1.8 x 3.2: 1 -2.8,0; 2 2.8,0
RS-2,5 = drill 0.813 long: 1 -1.27,0; 2 1.27,0
P0817/22 = drill 1.016 octagon: 1 -11.43,0; 2 11.43,0
PICO = smd 3.2 x 1.6: 1 0.81,49.63; 2 0.81,47.09; 3 0.81,44.55; 4 0.81,42.01; 5 0.81,39.47; 6 0.81,36.93; 7 0.81,34.39; 8 0.81,31.85; 9 0.81,29.31; 10 0.81,26.77; 11 0.81,24.23; 12 0.81,21.69; 13 0.81,19.15; 14 0.81,16.61; 15 0.81,14.07; 16 0.81,11.53; 17 0.81,8.99; 18 0.81,6.45; 19 0.81,3.91; 20 0.81,1.37; 21 20.19,1.37; 22 20.19,3.91; 23 20.19,6.45; 24 20.19,8.99; 25 20.19,11.53; 26 20.19,14.07; 27 20.19,16.61; 28 20.19,19.15; 29 20.19,21.69; 30 20.19,24.23; 31 20.19,26.77; 32 20.19,29.31; 33 20.19,31.85; 34 20.19,34.39; 35 20.19,36.93; 36 20.19,39.47; 37 20.19,42.01; 38 20.19,44.55; 39 20.19,47.09; 40 20.19,49.63 | smd 1.6 x 3.2: D1 7.96,0.8; D2 10.5,0.8; D3 13.04,0.8 | smd 1.5 x 1.5: TP1 10.5,46.5; TP2 11.5,49.8; TP3 9.5,49.8; TP4 8,43; TP5 8,40.5; TP6 8,38

### Placement (x,y rotation side)
3V3  11.18,10.16 90 top
5V  5.84,10.16 90 top
12V  14.48,10.16 90 top
-5V  7.62,10.16 90 top
-12V  9.4,10.16 90 top
C1  10.16,85.09 270 top
C2  49.02,45.72 0 top
C3  66.04,69.85 0 top
C4  81.28,90.17 180 bottom
C5  6.1,71.37 270 top
C6  12.7,95.5 0 top
C7  92.46,61.98 180 top
C8  13.97,42.67 0 top
C9  41.91,26.67 180 top
C10  41.91,29.21 180 top
C11  24.64,34.54 180 top
C12  24.64,37.59 180 bottom
C13  24.64,25.65 180 top
C14  24.64,28.45 180 bottom
C15  11.68,21.84 270 top
C16  7.62,21.84 270 top
C17  19.05,21.84 270 top
C18  14.99,21.84 270 top
C19  2.03,21.84 270 top
C20  4.06,17.02 180 top
C21  25.91,4.32 90 top
C22  29.21,19.05 270 top
C23  3.3,76.2 270 top
C24  54.61,55.88 270 top
C25  50.04,59.69 270 bottom
C26  38.1,55.88 270 top
C27  21.59,55.88 270 top
C28  82.55,86.36 180 top
C29  66.04,86.36 0 top
C30  82.55,69.85 180 top
C31  50.29,52.07 90 bottom
C32  22.1,19.05 270 top
C33  21.59,4.32 90 top
C34  81.28,66.04 180 bottom
C35  46.23,59.69 270 bottom
C36  11.18,32.51 180 bottom
C37  17.53,29.97 90 top
C38  14.99,29.97 90 top
C39  6.1,32.51 270 top
C40  3.56,32.51 270 top
C41  43.94,43.69 0 top
C42  38.86,43.69 0 top
C43  43.18,8.89 270 top
C44  48.26,83.82 90 bottom
C45  52.07,83.82 90 bottom
C46  44.45,83.82 90 bottom
C47  40.64,83.82 90 bottom
C48  36.83,83.82 90 bottom
C49  27.94,77.47 270 bottom
C50  31.75,77.47 270 bottom
C51  45.72,77.47 270 bottom
C52  49.53,77.47 270 bottom
C53  76.2,45.72 270 bottom
C54  81.28,82.04 180 bottom
C55  81.28,77.72 180 bottom
C56  81.28,73.66 180 bottom
C57  67.31,90.42 0 bottom
C58  67.31,82.04 0 bottom
C59  67.31,77.98 0 bottom
C60  67.31,73.66 0 bottom
C61  67.31,66.04 0 bottom
C62  17.27,78.74 270 top
C63  42.67,52.07 90 bottom
C64  26.16,52.07 90 bottom
C65  33.53,59.69 270 bottom
C66  29.72,59.69 270 bottom
C67  33.78,52.07 90 bottom
C68  29.97,52.07 90 bottom
C69  25.91,59.69 270 bottom
C70  42.42,59.69 270 bottom
C71  46.48,52.07 90 bottom
C72  68.58,45.72 270 bottom
C73  71.12,45.72 270 bottom
C74  73.66,45.72 270 bottom
C75  53.34,77.47 270 bottom
C76  25.4,83.82 90 bottom
C77  29.21,83.82 90 bottom
C78  33.02,83.82 90 bottom
C79  24.13,77.47 270 bottom
C80  66.04,45.21 90 top
C81  25.4,10.92 270 bottom
D1  38.1,12.7 0 top
D2  38.1,10.16 0 top
D3  17.53,36.32 90 top
D4  20.32,95.76 180 top
D5  3.81,70.87 270 top
D6  20.83,30.23 270 bottom
D7  24.89,31.24 0 bottom
D8  38.1,15.24 0 top
D9  46.99,99.06 0 top
D10  38.1,7.62 0 top
D11  31.24,45.47 0 top
D12  86.36,52.07 0 bottom
D13  92.71,78.74 270 top
D14  6.86,50.8 270 top
FAN  31.24,42.42 180 top
IC1  7.62,78.74 270 top
IC2  11.18,29.97 0 top
IC3+-  25.4,11.43 0 top
IC4  93.98,58.42 90 top
IC5  34.29,30.48 270 top
IC6  4.06,19.05 0 top
IC7  9.65,19.05 0 top
IC8  17.02,19.05 0 top
IC9  13.97,45.72 180 top
IC10  72.39,43.18 0 top
IN+  3.81,59.69 90 top
IN-  3.81,46.99 90 top
JP1  66.04,6.35 180 top
L2  11.18,36.83 180 top
LED1  10.16,71.37 90 top
OUT+  96.52,86.36 90 top
OUT-  96.52,71.12 90 top
PAD1  25.4,90.17 0 top
PAD2  27.94,90.17 0 top
PAD3  52.07,90.17 0 top
PAD4  49.53,90.17 0 top
PAD5  52.07,67.31 0 top
PAD6  49.53,67.31 0 top
PAD7  25.4,67.31 0 top
PAD8  27.94,67.31 0 top
Q1  26.67,96.52 0 top
Q2  43.69,13.97 270 top
Q3  36.83,4.06 270 top
Q4  68.07,58.17 0 top
Q5  26.67,42.42 0 top
Q6  91.44,41.91 90 top
Q7  70.87,50.8 90 top
Q8  67.06,50.8 90 top
R1  4.32,67.06 180 top
R2  38.1,93.98 90 top
R3  34.29,93.98 90 top
R4  9.4,67.06 0 top
R5  8.13,71.37 90 top
R6  17.78,98.04 180 top
R7  12.7,98.04 180 top
R8  93.98,58.42 180 bottom
R9  93.98,62.48 180 bottom
R10  24.13,19.05 270 top
R11  19.05,4.32 90 top
R12  96.01,48.77 0 bottom
R13  91.95,48.77 0 bottom
R14  86.11,46.99 0 bottom
R15  41.91,31.75 180 top
R16  35.05,36.58 0 top
R17  27.94,4.32 90 top
R18  26.67,19.05 270 top
R19  9.65,63.5 270 top
R20  41.91,3.05 180 top
R21  38.1,17.78 0 top
R22  3.3,80.26 90 top
R23  88.65,41.91 90 top
R24  49.02,40.89 0 top
R25  49.02,43.69 0 top
R26  60.45,55.12 270 bottom
R27  60.45,50.8 270 bottom
R28  62.48,45.72 180 bottom
R29  10.92,43.43 90 top
R30  13.97,48.26 180 bottom
R31  13.97,52.32 180 bottom
R32  13.72,26.16 0 top
R33  6.86,25.4 180 top
R34  6.86,27.69 0 top
R35  3.56,27.94 270 top
R36  23.88,42.42 90 top
R37  43.94,40.89 0 top
R38  43.94,45.72 0 top
R39  38.86,40.89 0 top
R40  38.86,45.72 0 top
R41  43.69,17.02 0 top
R42  10.41,13.21 180 top
R45  6.35,13.21 0 top
R46  14.48,13.97 90 top
R47  16.26,26.67 90 bottom
R48  86.36,52.07 0 top
R49  70.87,53.85 180 top
R50  66.8,53.85 0 top
R51  64.01,50.8 270 top
R52  41.91,5.08 180 top
R53  73.66,40.64 270 bottom
R54  71.12,40.64 270 bottom
R55  68.58,40.64 270 bottom
R56  76.2,40.64 270 bottom
R88  11.18,9.14 0 bottom
R89  6.86,9.14 180 bottom
RPI_PICO  48.26,35.56 270 top
VDD  12.95,10.16 90 top

### Tracks (layer width: path | path; a pad name or v marks a point on that pad's centre or on a via)
+3V3  (via drill 0.35)
  Top 0.406: v8.89,15.49 8.89,13.78 R42.2
  Top 0.508: IC4.6 91.95,60.75 91.95,60.96 91.95,61.53 C7.2 | 9.4,45.21 9.4,62.3 R19.2
  Top 0.61: IC8.1 14.99,19.81 C18.2 | 91.95,60.96 90.42,59.44 90.42,54.86 v83.06,47.5 | IC10.16 67.85,46.16 C80.2 64.2,46.16 v61.21,43.18 59.44,44.96 v55.63,44.96 | v74.17,18.8 65.86,27.11 65.69,27.11 63.5,29.3 v63.5,31.75 | v76.71,21.59 83.31,21.59 87.38,17.53 | RPI_PICO.36 87.38,15.72 87.38,17.53 | R23.2 88.2,42.42 86.36,42.42 | 86.36,42.42 82.8,42.42 v81.03,44.2 | 86.36,42.42 v86.36,40.64 | v88.9,19.05 87.38,17.53 | R39.1 36.83,40.13 22.1,40.13 v21.59,40.64 | v10.41,38.86 10.41,41.98 R29.1 10.35,42.48 9.4,43.43 9.4,45.21
  Top 0.813: RPI_PICO.36 87.73,14.07 84.33,10.67 75.95,10.67 73.66,8.38 JP1.9 JP1.10 70,1.42 43.18,1.42 | v16.26,13.46 16.26,2.29 17.12,1.42 43.18,1.42 | IC8.1 15.75,18.03 v14.22,16.51 | R20.1 43.18,2.73 43.18,1.42
  Bottom 0.406: v14.22,16.51 13.97,16.76 10.16,16.76 v8.89,15.49 | 37.59,39.12 37.59,39.37
  Bottom 0.61: v81.03,44.2 81.03,45.47 v83.06,47.5 | v61.21,43.18 61.21,34.04 v63.5,31.75 | v74.17,18.8 76.71,21.34 v76.71,21.59 | v86.36,40.64 86.36,39.53 86.43,39.46 86.43,36.76 91.44,31.75 91.44,21.59 v88.9,19.05 | R24.1 47.75,39.62 46.74,38.61 42.67,38.61 | 42.67,38.61 38.1,38.61 37.59,39.12 | 37.59,39.37 R39.1 | 42.67,38.61 R37.1 42.67,43.43 44.2,44.96 v55.63,44.96 | v21.59,40.64 19.81,38.86 v10.41,38.86
  Bottom 0.813: v14.22,16.51 16.26,14.48 v16.26,13.46
+5V  (via drill 0.35)
  Top 0.305: IC3+-.4 25.4,7.87 27.18,9.65 28.96,9.65 29.21,9.4 29.21,5.84 29.72,5.33 33.78,5.33 34.8,6.35 37.59,6.35 38.1,6.86 38.1,16.51 37.15,17.46 R21.1
  Top 0.406: R45.2 7.3,16.19 8.89,17.78
  Top 0.61: IC7.1 7.62,19.81 C16.2
  Top 0.813: IC7.1 8.38,18.29 8.89,17.78 v11.68,14.99
  Bottom 0.406: 13.72,10.41 14.16,9.97 C81.2
  Bottom 0.508: IC3+-.4 C81.2
  Bottom 0.813: JP1.5 JP1.6 78.74,2.69 77.47,1.42 16.61,1.42 13.72,4.32 13.72,10.41 13.72,12.95 v11.68,14.99
+12V  (via drill 0.35)
  Top 0.406: IC1.3 8.27,82.69 9.72,84.14 C1.2 | R46.2 18.29,18.73 IC8.3 | 5.91,24.83 R33.2 5.84,25.33 v5.84,21.08 | IC5.4 29.72,26.67 28.19,28.19 26.16,28.19 24.89,26.92 24.89,23.37 v23.88,22.35
  Top 0.508: R49.2 R50.2 67.75,54.17 66.55,55.37 64.26,55.37 58.17,49.28 v57.91,49.28 | v24.13,48.01 17.27,48.01 14.99,50.29 14.99,62.48 13.97,63.5 13.97,80.33 C1.2
  Top 0.61: R16.2 38.1,34.48 IC5.8 | IC7.3 11.68,19.81 C15.2 | IC8.3 19.05,19.81 C17.2 | D11.K 33.29,43.2 FAN.1 | 10.41,36.83 11.18,36.83 12.19,37.85 12.19,38.86 13.72,40.39
  Top 0.813: L2.2 10.41,36.83 | 13.72,40.39 v18.54,40.39 | v86.36,21.59 83.82,24.13 76.2,24.13 v74.93,25.4 | v69.85,20.32 v46.99,20.32
  Top 1.27: L2.2 7.98,35.79 C39.1 C40.1
  Bottom 0.406: v5.84,21.08 6.86,20.07 6.86,18.29 7.87,17.27 9.14,17.27 IC7.3 12.45,17.53 16.76,17.53 IC8.3 19.56,20.32 21.84,20.32 v23.88,22.35
  Bottom 0.508: v57.91,49.28 57.91,43.94 48.26,34.29 IC5.8 | 24.13,45.21 v24.13,48.01
  Bottom 0.61: 33.4,27.05 34.29,27.94 34.29,33.02 35.56,34.29 IC5.8 32.51,39.88 FAN.1 | 33.4,27.05 33.02,26.67 IC5.4 | 43.18,20.32 35.81,20.32 34.04,22.1 34.04,23.62 34.8,24.38 34.8,25.65 33.4,27.05
  Bottom 0.813: v18.54,40.39 23.37,45.21 24.13,45.21 30.99,45.21 32.51,43.69 FAN.1 | JP1.2 JP1.1 83.82,19.05 v86.36,21.59 | v74.93,25.4 v69.85,20.32 | v46.99,20.32 43.18,20.32
-5V  (via drill 0.35)
  Top 0.406: C20.1 5.01,15.17 3.81,13.97 v3.81,10.16
  Top 0.61: C20.1 5.01,18.73 IC6.3
  Bottom 0.406: v3.81,10.16 4.83,9.14 R89.1 | C81.1 16.32,11.87 12.19,16 11.18,16 9.65,14.48 8.64,14.48 5.33,17.78 IC6.3
  Bottom 0.508: C81.1 IC3+-.11
-12V  (via drill 0.35)
  Top 0.406: C13.- v22.1,21.84
  Top 0.61: C19.1 3.37,22.79 4.06,22.1 IC6.2
  Bottom 0.406: R88.1 12.13,9.46 4.06,17.53 IC6.2 4.06,21.08 5.33,22.35 17.78,22.35 18.29,21.84 v22.1,21.84
  Bottom 0.61: C13.- 20.83,26.92 D6.A 20.91,28.45 C14.1
A  (via drill 0.35)
  Top 0.406: IC10.11 74.3,44.58 74.93,43.94 75.95,43.94 80.01,39.88 v80.01,38.61 | v62.99,18.29 62.99,16.03 RPI_PICO.26
  Bottom 0.406: v80.01,38.61 80.01,35.31 v62.99,18.29
ADC0  (via drill 0.35)
  Top 0.406: v59.69,12.95 73.66,12.95 75.03,14.32 RPI_PICO.31
  Bottom 0.406: JP1.25 53.34,10.92 55.37,12.95 v59.69,12.95
ADC1-MUX  (via drill 0.35)
  Top 0.406: IC10.4 71.75,38.48 v71.88,38.35 | v69.6,32 67.56,32 66.04,30.48 v66.04,27.94
  Bottom 0.406: v71.88,38.35 71.88,34.29 v69.6,32 | v66.04,27.94 50.8,12.7 JP1.27
ADC2  (via drill 0.35)
  Top 0.406: v59.69,11.68 80.01,11.68 82.65,14.32 RPI_PICO.34
  Bottom 0.406: JP1.26 54.61,6.35 54.61,10.16 56.13,11.68 v59.69,11.68
ANALOG-MUTLIPLEX  (via drill 0.35)
  Top 0.406: RPI_PICO.32 77.46,15.48 77.46,18.39 68.58,27.26 v68.58,30.99 | v70.36,38.35 70.36,39.98 IC10.3
  Bottom 0.406: v68.58,30.99 68.58,36.58 v70.36,38.35
B  (via drill 0.35)
  Top 0.406: IC10.10 75.56,44.83 75.69,44.7 76.2,44.7 81.28,39.62 v81.28,39.37 | v65.02,18.29 65.02,15.52 RPI_PICO.27
  Bottom 0.406: v81.28,39.37 81.28,34.54 v65.02,18.29
C  (via drill 0.35)
  Top 0.406: IC10.9 76.83,45.59 82.55,39.88 v82.55,39.37 | v69.85,18.54 69.95,18.44 RPI_PICO.29
  Bottom 0.406: v82.55,39.37 82.55,31.24 v69.85,18.54
CS
  Top 0.406: IC1.7 5.67,90.76
  Top 0.508: R7.2 10.41,98.04 8.89,96.52 8.89,93.98 5.67,90.76
CS1  (via drill 0.35)
  Top 0.508: Q1.3 29.21,98.73 19.42,98.73 R6.1 18.73,95.87 D4.A
  other vias: 32.51,98.3 33.53,98.3 34.54,98.3 35.56,98.3 36.58,98.3 37.59,98.3 38.61,98.3 39.62,98.3 32,97.54 32,96.52 40.39,97.54 40.39,96.52
  pour Top (no thermals): 28.45,99.06 28.45,95.5 29.97,93.98 30.48,93.98 40.64,93.98 41.91,95.25 41.91,99.06
  pour Bottom (isolate 0.406, no thermals): 41.15,94.49 41.15,98.06 40.15,99.06 29.45,99.06 28.45,98.06 28.45,95.5 29.97,93.98 40.64,93.98
CURRENT-IN  (via drill 0.35)
  Top 0.305: 39.37,37.59 75.18,37.59
  Top 0.406: IC9.1 17.46,44.77 20.07,42.16 20.07,39.37 | 20.07,39.37 20.07,24.64 20.57,24.13 20.57,15.49 IC3+-.13 | 20.07,39.37 34.54,39.37 35.05,38.86 38.1,38.86 39.37,37.59 | 75.18,37.59 v75.69,38.1
  Bottom 0.406: R56.2 75.69,39.18 v75.69,38.1
CURRENT-OUT  (via drill 0.35)
  Top 0.406: v86.11,44.96 93.03,51.88 93.03,53.66 | v36.83,22.1 30.48,15.75 IC3+-.9
  Top 0.61: 93.03,53.66 IC4.1
  Bottom 0.254: 72.39,40.64 77.47,40.64
  Bottom 0.305: R54.2 72.07,40.64 72.39,40.64
  Bottom 0.406: v36.83,22.1 37.59,21.34 44.96,21.34 52.83,29.21 69.34,29.21 79.88,39.75 | v86.11,44.96 85.6,44.45 84.58,44.45 79.88,39.75 | 77.47,40.64 78.99,40.64 79.88,39.75
ENABLE-OUT
  Top 0.61: RPI_PICO.5 87.73,40.04 R23.1 90.39,40.96 Q6.1
FAN-EN  (via drill 0.35)
  Top 0.305: 76.2,36.83 38.86,36.83
  Top 0.406: RPI_PICO.9 77.47,34.85 77.47,35.56 76.2,36.83 | v26.92,43.69 26.6,43.37 25.4,43.37 | 38.86,36.83 37.59,38.1 v30.48,38.1
  Top 0.61: R36.2 25.4,43.37 Q5.1
  Bottom 0.406: v30.48,38.1 26.92,41.66 v26.92,43.69
FEEDBACK  (via drill 0.35)
  Top 0.406: IC1.10 6.97,74.79 5.84,73.66 5.16,73.66 4.06,72.57 D5.C 1.27,70.03 1.27,37.13 v1.39,36.83 | C43.2 44.77,7.94 44.96,8.13 44.96,10.41 43.94,11.43 43.43,11.43 v41.91,12.95
  Top 0.508: C43.2 43.18,5.4 R52.1
  Bottom 0.305: 40.13,12.95 29.72,23.37
  Bottom 0.406: v1.39,36.83 1.39,34.67 3.81,32.26 3.81,26.67 7.11,23.37 29.72,23.37 | v41.91,12.95 40.13,12.95
GATE
  Top 0.508: D4.C 22.35,95.76 | 22.35,95.76 23.37,95.76 Q1.1 | IC1.4 7.62,88.9 12.19,93.47 20.07,93.47 22.35,95.76
GND  (via drill 0.35)
  Top 0.2: 94.93,60.96 93.98,60.96
  Top 0.254: R4.1 8.45,68.26 v8.38,68.33
  Top 0.305: IC4.4 94.93,60.96 94.93,62.55 93.98,63.5 v92.2,63.5 | v67.31,49.53 67.79,49.53 Q8.2 68.01,49.84 67.06,50.8 65.79,50.8 64.84,51.75 R51.1 | Q7.2 71.6,49.53 v71.12,49.53 | IC1.9 6.32,77.95 6.35,77.98 | 5.59,69.09 v5.33,69.09
  Top 0.406: IC9.5 v11.43,45.72 | IC9.3 16.07,46.67 v16.76,45.97 | Q6.2 92.39,36.38 92.81,35.97 RPI_PICO.3 | IC1.6 6.32,83.28 v6.6,83.57 6.97,83.2 IC1.5 | v8.89,85.85 9.97,85.85 C1.1 | C32.1 22.61,20.51 22.61,20.83 23.11,21.34 24.38,21.34 25.4,22.35 v25.91,22.35
  Top 0.508: C7.1 93.98,61.4 93.98,60.96 IC4.5 93.98,58.42 | v84.58,45.47 91.44,52.32 91.44,57.91 91.95,58.42 93.98,58.42 | IC4.2 93.98,58.42 | 95,59.74 IC4.4 | v3.3,82.55 R22.2
  Top 0.813: v5.59,79.5 6.86,79.5 IC1.15 | v5.59,78.74 IC1.15 | v5.59,77.98 6.35,77.98 6.86,77.98 IC1.15 | v9.65,79.5 8.38,79.5 IC1.15 | v9.65,78.74 IC1.15 | v9.65,77.98 8.38,77.98 IC1.15 | v10.41,95.5 C6.1 | v2.29,69.09 3.73,69.09 D5.A 3.89,69.09 v5.33,69.09 6.1,69.85 C5.2 R5.1 10.06,70.42 LED1.C | v15.24,78.74 15.04,78.54 15.04,64.21 17.78,61.47 17.78,55.88
  Bottom 0.305: v92.2,63.5 | v67.31,49.53 67.31,48.26 | v71.12,49.53 71.12,48.26
  Bottom 0.406: 15.88,47.62 16.51,48.26 | R30.2 v16.76,45.97 16.51,45.72 v11.43,45.72
  Bottom 0.508: R14.2 85.09,46.92 85.09,45.72 84.84,45.47 v84.58,45.47 | R9.1 v92.2,63.5
  Bottom 1.016: v16.76,45.97 17.78,44.96 v17.78,41.91 | v9.65,78.74 v15.24,78.74
  Bottom 1.27: 73.66,63.5 73.66,61.21 Q4.3 70.61,61.47 69.85,62.23
  other vias: 24.64,59.94 25.65,59.94 26.67,59.94 27.69,59.94 28.7,59.94 29.72,59.94 30.73,59.94 31.75,59.94 32.77,59.94 33.78,59.94 34.8,59.94 41.15,59.94 42.16,59.94 43.18,59.94 44.2,59.94 45.21,59.94 46.23,59.94 47.24,59.94 48.26,59.94 49.28,59.94 50.29,59.94 51.31,59.94 8.38,29.97 5.33,29.46 7.62,29.97 2.03,31.5 2.03,30.48 16,34.54 16,33.53 19.05,34.54 19.05,33.53 17.02,32.77 18.03,32.77 15.24,33.02 18.29,53.59 18.29,52.58 18.29,51.56 18.29,50.55 18.29,49.53 35.81,43.94 3.3,35.81 44.96,33.27 54.86,43.43 46.99,2.79 63.75,2.79 2.79,11.68 10.41,4.06 14.99,5.08 10.41,25.65 18.03,25.65 1.52,25.65 64.01,43.94 79.76,45.47 85.6,39.12 96.52,42.42 55.37,46.74 54.61,31.5 41.15,17.78 41.4,35.56 30.99,20.57 46.74,18.54 23.88,4.06 29.97,4.06 51.82,39.37 57.15,39.37 62.99,46.99 22.35,41.66 94.74,44.2 90.17,38.1 62.99,41.15 59.18,46.74 33.02,29.46 57.91,22.1
  pour Bottom (isolate 1.016, no thermals): 92.46,55.88 74.93,55.88 67.82,62.99 67.82,91.95 68.58,92.71 79.76,92.71 80.77,91.69 80.77,64.52 81.79,63.5 89.41,63.5 90.3,64.39 92.08,64.39 92.46,64.01
  pour Top (isolate 0.61, no thermals): 16.51,57.15 22.13,57.15 arc90 24.13,59.15 24.13,63.26 25.13,64.26 29.73,64.26 30.73,65.26 30.73,93.22 41.93,93.22 42.93,92.22 42.93,81.28 55.88,68.33 55.88,50.53 54.88,49.53 19.05,49.53 19.05,49.02 17.76,49.02 16.51,50.28
  pour Bottom (isolate 0.813, no thermals): 15.24,46.74 15.24,54.86 15.49,55.12 21.84,55.12 25.15,51.82 35.05,51.82 37.34,54.1 39.12,54.1 41.4,51.82 51.82,51.82 53.85,53.85 56.13,53.85 57.15,52.83 57.15,50.55 55.63,49.02 22.86,49.02 20.07,46.23 15.75,46.23
  pour Bottom (isolate 0.61, no thermals): 24.64,62.48 34.8,62.48 35.31,61.98 35.31,61.72 35.31,59.69 35.05,59.44 24.64,59.44 24.13,59.94 24.13,61.98
  pour Bottom (isolate 0.61, no thermals): 41.15,62.48 51.31,62.48 51.82,61.98 51.82,61.72 51.82,59.69 51.56,59.44 41.15,59.44 40.64,59.94 40.64,61.98
  pour Bottom (isolate 0.305): 0,0 0,40.13 12.7,40.13 18.03,45.47 20.32,45.47 23.11,48.26 80.01,48.26 82.55,45.72 100.08,45.72 100.08,0
  pour Bottom (isolate 0.305): 0,0 0,40.13 12.7,40.13 18.03,45.47 20.32,45.47 23.11,48.26 80.01,48.26 82.55,45.72 100.08,45.72 100.08,0
  pour Top (isolate 0.305): 0,0 0,39.13 1,40.13 12.7,40.13 18.03,45.47 20.32,45.47 23.11,48.26 80.01,48.26 82.55,45.72 100.08,45.72 100.08,0
  pour Bottom (isolate 0.305): 0,68.58 0,99.08 1,100.08 12.7,100.08 13.72,99.06 13.72,72.64 10.92,69.85 8.38,67.31 1.27,67.31
GP8  (via drill 0.35)
  Top 0.406: RPI_PICO.11 72.49,29.82 v71.88,29.21
  Bottom 0.406: v71.88,29.21 71.88,28.45 61.72,18.29 61.72,9.4 62.23,8.89 62.23,6.35 JP1.18
GP9  (via drill 0.35)
  Top 0.406: RPI_PICO.12 69.95,33.68 70.61,33.02 70.61,29.21 v69.6,28.19
  Bottom 0.406: JP1.19 60.71,7.87 60.71,18.8 69.6,27.69 v69.6,28.19
GP15  (via drill 0.35)
  Top 0.406: RPI_PICO.20 49.63,34.14 44.45,28.96 44.45,25.4 44.2,25.15 v33.53,25.15 | v44.45,19.05 44.45,17.21 R41.2 | JP1.20 60.96,4.57 59.44,3.05 50.55,3.05 49.53,4.06 49.53,10.13 Q2.1
  Top 0.508: R41.2 Q2.1
  Bottom 0.305: 32.51,22.08 35.54,19.05
  Bottom 0.406: v33.53,25.15 32.51,24.13 32.51,22.08 | 35.54,19.05 v44.45,19.05
GP15-DRAIN
  Top 0.508: Q2.3 46.48,10.13 46.48,5.59 46.99,5.08 JP1.30
I2C-SCL  (via drill 0.35)
  Top 0.406: RPI_PICO.7 82.65,29.31 v82.55,29.21
  Bottom 0.406: v82.55,29.21 64.77,11.43 64.77,6.35 JP1.16
I2C-SDA  (via drill 0.35)
  Top 0.406: v85.09,31.75 85.09,35.56 85.19,35.46 RPI_PICO.6
  Bottom 0.406: JP1.15 66.04,8.89 85.09,27.94 v85.09,31.75
I-CV
  Top 0.508: R18.2 27.94,18.1 | 27.94,18.1 C22.2 | 27.94,18.1 IC3+-.10
I-PWM-IN
  Top 0.406: RPI_PICO.19 52.17,32.36 50.8,30.99 48.01,30.99 45.47,28.45 45.47,24.89 44.7,24.13 29.46,24.13 26.67,21.34 25.47,21.34 R10.1
I-PWM-OUT
  Top 0.406: RPI_PICO.16 59.79,29.31 57.66,27.18 54.1,27.18 52.07,29.21 47.24,29.21 46.48,28.45 46.48,24.13 45.72,23.37 30.23,23.37 26.86,20 R18.1
IN_GND  (via drill 0.35)
  Top 0.406: IC9.2 14.48,45.72 | 14.48,45.72 13.53,46.67 IC9.4 12.7,46.69 v12.7,48.26 | 14.48,45.72 13.97,45.21 13.97,43.94 14.92,42.99 C8.2
  Bottom 0.406: v12.7,48.26 R30.1
  pour Bottom (no thermals): 1.27,52.07 1.27,41.91 2.54,40.64 2.79,40.64 10.16,40.64 12.7,43.18 12.7,53.34 12.7,54.61 12.19,55.12 9.65,55.12 9.14,54.61 8.38,53.85 2.29,53.85 1.27,52.83
N$1
  Top 0.254: 12.19,72.39 12.19,68.9 R4.2 | 7.11,63.5 11.43,63.5
  Top 0.406: IC1.14 9.57,75.01 12.19,72.39 | R1.1 5.33,67.06 6.1,66.29 6.1,64.52 7.11,63.5 | 11.43,63.5 13.97,60.96 13.97,50.04 17.27,46.74 33.53,46.74 34.8,48.01 78.99,48.01 83.57,43.43 86.87,43.43 87.88,44.45 90.93,44.45 91.44,43.94 Q6.3
  Top 0.508: R4.2 11.43,65.97 11.43,63.5
N$2  (via drill 0.35)
  other vias: 23.37,82.55 23.37,81.53 23.37,80.52 24.13,81.03 24.89,80.52 25.65,81.03 26.42,80.52 27.18,81.03 27.94,80.52 28.7,81.03
  pour Bottom (no thermals): 22.35,77.98 56.39,77.98 56.39,83.31 22.35,83.31
  pour Top (isolate 0.61, no thermals): 29.97,92.96 29.97,77.47 21.59,77.47 15.24,83.82 15.24,90.93 17.02,92.71 23.13,92.71 25.4,94.98 25.4,98.04 27.94,98.04 27.94,95
  pour Bottom (no thermals): 15.24,90.93 15.24,85.09 22.35,77.98 22.86,77.98 22.86,87.63 23.62,88.39 29.21,88.39 29.97,89.15 29.97,92.96 27.94,95 27.94,98.06 25.4,98.06 25.4,95 23.11,92.71 17.02,92.71
N$3  (via drill 0.35)
  other vias: 51.56,76.45 51.56,75.44 51.56,74.42 53.34,74.42 55.63,74.42 55.63,76.45 55.63,75.44 46.23,84.84 46.23,85.85 46.23,86.87 45.21,86.87 44.2,86.87 22.86,74.42 23.88,74.42 24.89,74.42 25.91,74.42 26.92,74.42 28.96,74.42 27.94,74.42
  pour Bottom (no thermals): 23.62,84.33 55.12,84.33 55.88,85.09 55.88,98.06 54.88,99.06 49.77,99.06 48.77,98.06 48.77,93.98 45.21,93.98 45.21,98.06 44.21,99.06 42.91,99.06 41.91,98.06 41.91,90.17 40.64,88.9 30.48,88.9 29.21,87.63 23.62,87.63
  pour Bottom (no thermals): 22.35,73.39 22.35,76.47 22.84,76.96 56.9,76.96 57.15,77.22 57.15,83.82 56.64,84.33 55.12,84.33 55.12,88.65 58.67,85.09 58.67,72.64 58.42,72.39 23.35,72.39
  pour Top: 43.69,88.9 43.69,81.53 52.83,72.39 57.91,72.39 57.91,80.79 56.91,81.79 52.07,81.79 44.96,88.9
  pour Top (no thermals): 16.26,74.68 16.26,65.53 17.02,64.77 19.05,64.77 20.32,66.04 20.32,69.85 22.86,72.39 28.45,72.39 29.46,73.41 29.46,75.18 28.45,76.2 17.78,76.2
N$4
  Top 0.508: R6.2 R7.1 C6.2
N$5
  Top 0.406: IC1.12 8.27,72.47 R5.2
N$6
  Top 0.406: IC1.11 7.62,73.91 6.1,72.39 C5.1
N$7  (via drill 0.35)
  Top 0.406: IC10.12 73.03,44.58 74.42,43.18 v75.18,43.18
  Bottom 0.61: C53.2 75.18,43.75 v75.18,43.18 75.18,42.61 R56.1
N$8
  Top 0.508: D10.C IC3+-.7
N$9
  Top 0.508: D1.C 19.05,12.7 17.78,13.97 IC3+-.14
N$10
  Bottom 0.61: R13.1 R12.2
N$11
  Top 0.61: R15.2 IC5.7 36.83,31.75 34.1,34.48 R16.1
N$12
  Top 0.406: R15.1 42.86,31.43 40.96,29.53 C10.2
  Top 0.61: C10.2 IC5.6 35.56,29.21 33.02,31.75 IC5.2
N$13
  Top 0.61: C9.2 IC5.5
N$14
  Bottom 0.61: IC5.3 29.46,29.21 28.19,30.48 28.19,33.53 C11.+ 27.18,36 C12.2
N$15
  Bottom 0.61: C12.1 23.69,36.39 22.1,34.8 C11.- 20.83,33.27 D6.C 22.51,31.93 D7.A
N$16
  Top 0.508: D8.C IC3+-.8
N$17
  Top 0.508: R21.2 39.8,17.03 D8.A D1.A D2.A D10.A 39.8,7.37 37.78,5.35 Q3.1
N$18
  Top 0.254: R19.1 7.94,64.45 6.86,65.53 6.86,68.33 7.62,69.09 10.92,69.09 11.43,69.6 11.43,71.15
  Top 0.406: IC1.13 8.92,73.66 LED1.A 11.43,71.15
N$19
  Top 0.406: IC1.8 3.85,75.8 C23.2
N$20
  Top 0.406: R22.1 C23.1
N$21
  Top 0.508: C32.2 22.86,18.1 | 22.86,18.1 R10.2 | IC3+-.12 22.86,18.1
N$22
  Top 0.61: R32.1 12.43,26.5 IC2.4
N$23  (via drill 0.35)
  Top 0.813: IC2.6 12.43,31.48
  Top 1.27: D3.K 17.25,38.1 15.24,38.1 14.38,37.24 L2.1 12.43,34.88 12.43,34.06 v12.45,34.04 12.45,31.5 12.43,31.48
  Bottom 0.61: 12.45,32.51 C36.2
  Bottom 1.27: C36.2 12.45,32.83 v12.45,34.04
N$24
  Top 1.27: Q5.3 FAN.2 29.97,44.69 D11.A
N$25  (via drill 0.35)
  Top 0.61: v8.38,30.99 9.86,30.99 IC2.1
  Bottom 0.61: C36.1 8.7,30.99 v8.38,30.99
N$26
  Bottom 0.61: R26.2 R27.1
N$27  (via drill 0.35)
  Top 0.61: IC10.15 69.22,43.81 v68.58,43.18
  Bottom 0.61: C72.2 v68.58,43.18 R55.1
N$28
  Top 0.508: D2.C 35.89,10.67 19.56,10.67 17.78,8.89 IC3+-.1
N$29
  Top 0.406: R29.2 11.31,44.77 12.7,44.77 | 12.7,44.77 IC9.6 | C8.1 12.7,42.99 12.7,44.77
N$30
  Top 0.508: C33.2 20.32,5.27 | 20.32,5.27 R11.2 | IC3+-.2 20.32,5.27
N$31
  Top 0.61: R33.1 R34.2
N$32
  Top 0.406: IC2.3 6.42,29.02 5.91,28.51 R34.1
  Top 0.61: R35.2 5.21,26.99 R34.1
N$33
  Top 0.406: R42.1 11.36,12.38 11.18,12.19 3V3.A
N$34
  Top 0.406: 5V.A 5.4,11.65 R45.1
N$35
  Top 0.406: R46.1 12V.A
N$36  (via drill 0.35)
  Top 0.406: VDD.A 12.95,19.05 13.46,19.56 v13.46,24.38
  Bottom 0.406: v13.46,24.38 14.92,24.38 R47.1
N$37  (via drill 0.35)
  Top 0.406: -5V.C v7.62,7.62
  Bottom 0.406: v7.62,7.62 7.62,8.96 R89.2
N$38  (via drill 0.35)
  Top 0.406: v9.65,7.62 9.4,7.87 -12V.C
  Bottom 0.406: R88.2 10.23,8.19 v9.65,7.62
N$39
  Bottom 1.27: Q4.2 68.07,55.12
  Bottom 2.54: D12.A R48.1 71.12,52.07 68.07,55.12
N$40
  Top 0.508: Q4.1 65.53,57.66 67.56,55.63 70.87,55.63
  Top 0.61: 70.87,55.63 71.37,55.12 71.37,54.29 | 71.37,54.29 R49.1 | Q7.3 71.37,52.36 71.37,54.29
N$41
  Top 0.61: Q7.1 69.09,50.57 69.09,51.56 68.58,52.07 67.28,52.07 Q8.3 66.04,52.87 66.04,53.66 R50.1
N$42
  Top 0.508: 40.74,3.27 R20.2 | 40.74,4.86 R52.2 R20.2 | Q3.3 40.93,3.01 R20.2
N$43  (via drill 0.35)
  Top 0.61: IC10.14 70.48,43.81 v71.12,43.18
  Bottom 0.61: C73.2 v71.12,43.18 R54.1
N$44  (via drill 0.35)
  Top 0.61: IC10.13 71.75,44.32 72.9,43.18 v73.15,43.18
  Bottom 0.61: C74.2 73.15,44.26 v73.15,43.18 73.15,42.1 R53.1
OUT-DISCHARGER
  Top 0.305: 86.36,30.48 87.88,32 93.47,32 93.98,32.51 93.98,43.18 91.95,45.21 87.63,45.21 86.61,44.2 84.33,44.2 79.76,48.77 66.8,48.77 66,49.57 66,49.85
  Top 0.406: RPI_PICO.10 75.03,30.38 78.49,26.92 82.8,26.92 86.36,30.48
  Top 0.61: R51.2 66,49.85 Q8.1
OUT_GND  (via drill 0.35)
  Top 0.508: IC4.3 98.02,57.17 v98.3,56.9
  other vias: 98.3,64.01 97.54,64.77 96.52,64.77 95.5,64.77 98.3,62.99 98.3,61.98 98.3,60.96 98.3,59.94 98.3,58.93 98.3,57.91
  pour Bottom (isolate 1.016, no thermals): 89.41,76.71 89.41,65.53 90.17,64.77 92.71,64.77 93.22,64.26 93.22,55.37 93.98,54.61 99.06,54.61 99.57,55.12 99.57,75.95 97.79,77.72 90.42,77.72
  pour Top (no thermals): 91.44,66.55 91.44,77.47 98.06,77.47 99.06,76.47 99.06,55.88 96.27,55.88 96.27,61.72
SPI-CS
  Top 0.406: RPI_PICO.22 52.17,13.36 57.91,7.62 JP1.21
SPI-RX
  Top 0.406: RPI_PICO.21 49.63,14.38 55.88,8.13 JP1.23
SPI-SCK  (via drill 0.35)
  Top 0.406: 57.15,15.27 RPI_PICO.24 57.25,14.32 55.63,12.7 55.63,11.43 v57.15,9.91
  Bottom 0.406: JP1.24 57.15,6.35 v57.15,9.91
SPI-TX
  Top 0.406: JP1.22 59.79,6.45 59.79,8.28 58.17,9.91 58.17,12.7 59.79,14.32 RPI_PICO.25
TEMP1
  Top 0.406: IC10.1 51.08,40.11 R24.2
  Top 0.61: C2.2 R25.2 49.97,41.21 R24.2
TEMP2  (via drill 0.35)
  Top 0.406: IC10.5 73.03,41.27 72.39,41.91 v53.34,41.91
  Top 0.61: R38.2 C41.2 44.89,41.21 R37.2
  Bottom 0.406: v53.34,41.91 52.07,43.18 46.99,43.18 45.21,41.4 R37.2
TEMP3
  Top 0.406: IC10.2 69.22,38.99 68.83,38.61 41.4,38.61 40.13,39.88 R39.2
  Top 0.61: R40.2 C42.2 39.81,41.21 R39.2
U-CV
  Top 0.508: C21.2 R17.2 IC3+-.5
U-PWM-IN  (via drill 0.35)
  Top 0.406: R11.1 18.48,2.79 v17.53,2.79 | v57.15,28.19 57.15,34.65 RPI_PICO.17
  Bottom 0.406: v17.53,2.79 30.73,2.79 31.75,3.81 34.29,3.81 57.15,26.67 v57.15,28.19
U-PWM-OUT  (via drill 0.35)
  Top 0.406: R17.1 28.77,2.54 v33.02,2.54 | v61.72,27.94 61.72,34.14 RPI_PICO.15
  Bottom 0.406: v33.02,2.54 36.32,2.54 v61.72,27.94
UART-RX  (via drill 0.35)
  Top 0.406: RPI_PICO.2 95.35,31.85 93.98,30.48 v89.41,30.48
  Bottom 0.406: JP1.14 67.31,6.35 67.31,8.38 v89.41,30.48
UART-TX  (via drill 0.35)
  Top 0.406: 97.79,31.75 97.79,34.65 RPI_PICO.1
  Top 0.508: 97.79,31.75 95.25,29.21 v90.17,29.21
  Bottom 0.406: JP1.13 v90.17,29.21
VDD  (via drill 0.35)
  Top 0.406: IC1.1 9.68,81.79 10.41,81.79 12.95,79.25 v12.95,66.29
  Top 0.61: R32.2 14.99,26.48 C38.1 | C38.1 C37.1 | IC2.5 13.59,29.97 C38.1
  Top 0.813: C37.1 17.53,28.19 v18.54,27.18 v17.78,27.18
  Top 1.016: R1.2 3.37,62.63 IN+.A2
  Bottom 0.406: R47.2 17.34,27.62 v17.78,27.18
  Bottom 0.61: R26.1 56.83,59.69 C24.+ | 5.22,36.83 1.17,40.88 1.17,54.51 3.81,57.15
  Bottom 0.813: v18.54,27.18 17.27,28.45 16.51,28.45 13.97,30.99 13.97,35.56 12.7,36.83 5.22,36.83 | 3.81,57.15 IN+.A1
  pour Bottom (isolate 1.016, rank 2, no thermals): 8.89,66.04 2.27,66.04 1.27,65.04 1.27,55.36 2.27,54.36 7.87,54.36 9.4,55.88 21.34,55.88 23.88,53.34 23.88,52.32 24.13,52.07 53.34,52.07 57.15,55.88 57.15,63.5 55.88,64.77 36.83,64.77 30.48,71.12 13.97,71.12
VOLTAGE-IN  (via drill 0.35)
  Top 0.406: v35.31,22.35 31.75,18.8 v31.5,18.8
  Bottom 0.305: IC3+-.3 22.86,6.6 24.13,5.33 28.19,5.33 29.21,6.35 29.21,16.51 v31.5,18.8
  Bottom 0.406: v35.31,22.35 37.08,24.13 39.94,24.13 R28.1 62.04,45.21 62.04,43.94 66.29,39.69
  Bottom 0.61: R55.2 66.29,39.69 | R28.1 60.45,46.8 R27.2
VOLTAGE-OUT  (via drill 0.35)
  Top 0.406: v41.4,22.35 39.12,22.35 34.54,17.78 v34.54,16.76 | v78.23,39.62 78.23,38.86 79.5,37.59 82.55,37.59 84.07,39.12 v84.07,40.64
  Bottom 0.406: IC3+-.6 30.48,8.89 34.54,12.95 v34.54,16.76 | v41.4,22.35 49.02,29.97 68.83,29.97 73.66,34.8 73.66,36.83 | 73.66,36.83 R53.2 | 73.66,36.83 75.69,36.83 78.23,39.37 v78.23,39.62 | v84.07,40.64 87.06,43.62 R14.1
  Bottom 0.61: 87.06,46.42 R14.1 88.83,48.77 R13.2
VOUT  (via drill 0.35)
  Top 1.27: v87.63,54.61 86.36,55.88 C30.+
  Bottom 0.61: R12.1 97.79,49.6 R48.2
  Bottom 1.27: D12.C 87.63,53 v87.63,54.61
  Bottom 2.54: R48.2 D12.C
  pour Top (isolate 1.016, no thermals): 58.42,95.25 58.42,65.77 59.42,64.77 90.17,64.77 90.17,78.74 98.57,78.74 99.57,79.74 99.57,94.25 98.57,95.25
  pour Bottom (no thermals): 66.8,92.2 66.8,64.77 60.69,64.77 59.69,65.77 59.69,92.2
  pour Bottom (no thermals): 81.79,91.95 81.79,64.77 87.88,64.77 87.88,92.2 81.79,92.2
  pour Top (isolate 0.61, no thermals): 45.72,89.15 45.72,98.06 46.72,99.06 47.26,99.06 48.26,98.06 48.26,94.74 49.02,93.98 52.07,93.98 53.34,95.25 59.69,95.25 59.69,82.55 52.32,82.55

### Text on the board
tNames: temp 10k | 6x 100n
bNames: buck-boost SEPIC DC-DC converter | "OC Septik V1.0" | IN 7-60V, OUT 0-80V 20A | Designed by Jedovcela | https://github.com/Jed0vcela/DC-DC-conveters | GP9 | gnd | ADC1-MUX | ADC0 | SPI-RX | SPI-CS | gnd | I2C-SDA | UART-TX | gnd | 3v3 | gnd | 5v | gnd | 12v | GP15-open drain | ADC2 | SPI-SCK | SPI-TX | GP15 | GP8 | I2C-SCL | 5v | gnd | gnd | 3v3 | gnd | gnd | 12v | UART-RX
tStop: ondrati | je | kaso | ®
bStop: skibidi ®